# EAGLE design mp3_eval (EAGLE 6.4)

## Sheet 1 of 10: Power Supply
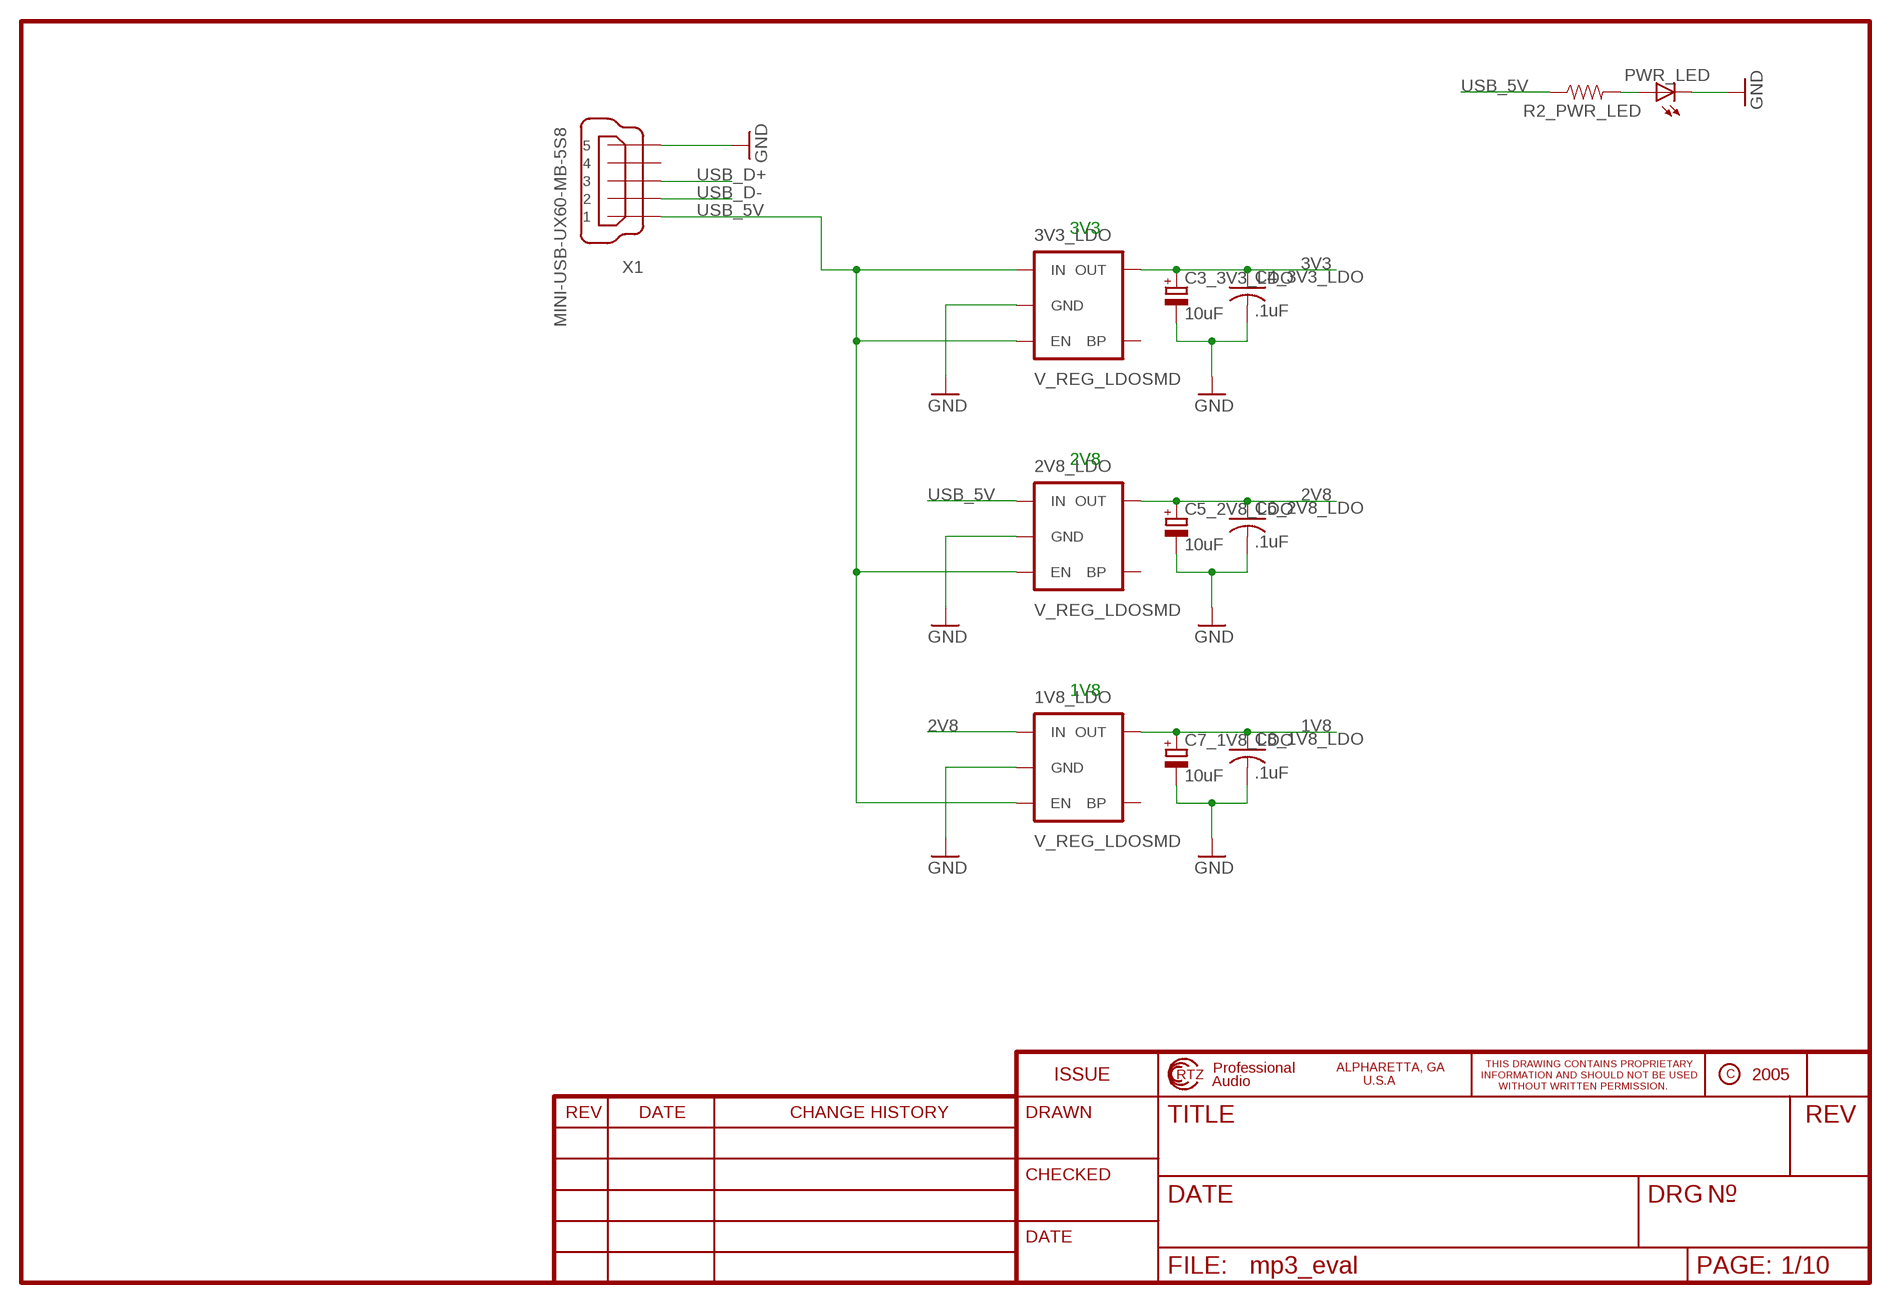
[diagram p0: schematic, sheet 1]

### Parts
1V8_LDO  V_REG_LDOSMD  [SOT23-5]
2V8_LDO  V_REG_LDOSMD  [SOT23-5]
3V3_LDO  V_REG_LDOSMD  [SOT23-5]
C3_3V3_LDO  10uF  CAPACITOR_POL-SMC_A  [SMC_A]
C4_3V3_LDO  .1uF  C-USC0402  [C0402]
C5_2V8_LDO  10uF  CAPACITOR_POL-SMC_A  [SMC_A]
C6_2V8_LDO  .1uF  C-USC0402  [C0402]
C7_1V8_LDO  10uF  CAPACITOR_POL-SMC_A  [SMC_A]
C8_1V8_LDO  .1uF  C-USC0402  [C0402]
PWR_LED  LEDCHIP-LED0603  [CHIP-LED0603]
R2_PWR_LED  RESISTOR0402-RES  [0402-RES]
X1  MINI-USB-UX60-MB-5S8  [UX60-MB-5S8]

### Nets
1V8: 1V8_LDO.5(OUT) C7_1V8_LDO.+ C8_1V8_LDO.1 ; also sheet 2,5
2V8: 1V8_LDO.1(IN) 2V8_LDO.5(OUT) C5_2V8_LDO.+ C6_2V8_LDO.1 ; also sheet 5
3V3: 3V3_LDO.5(OUT) C3_3V3_LDO.+ C4_3V3_LDO.1 ; also sheet 2,3,4,5,6
GND: 1V8_LDO.2(GND) 2V8_LDO.2(GND) 3V3_LDO.2(GND) C3_3V3_LDO.- C4_3V3_LDO.2 C5_2V8_LDO.- C6_2V8_LDO.2 C7_1V8_LDO.- C8_1V8_LDO.2 PWR_LED.C X1.5 ; also sheet 2,3,4,5,6
N$1: PWR_LED.A R2_PWR_LED.2
USB_5V: 1V8_LDO.3(EN) 2V8_LDO.1(IN) 2V8_LDO.3(EN) 3V3_LDO.1(IN) 3V3_LDO.3(EN) R2_PWR_LED.1 X1.1
USB_D+: X1.3 ; also sheet 9
USB_D-: X1.2 ; also sheet 9
Unconnected: 1V8_LDO.4(BP) 2V8_LDO.4(BP) 3V3_LDO.4(BP) X1.4

### Notes on the sheet
- 3V3
- 2V8
- 1V8

## Sheet 2 of 10: Header Pins
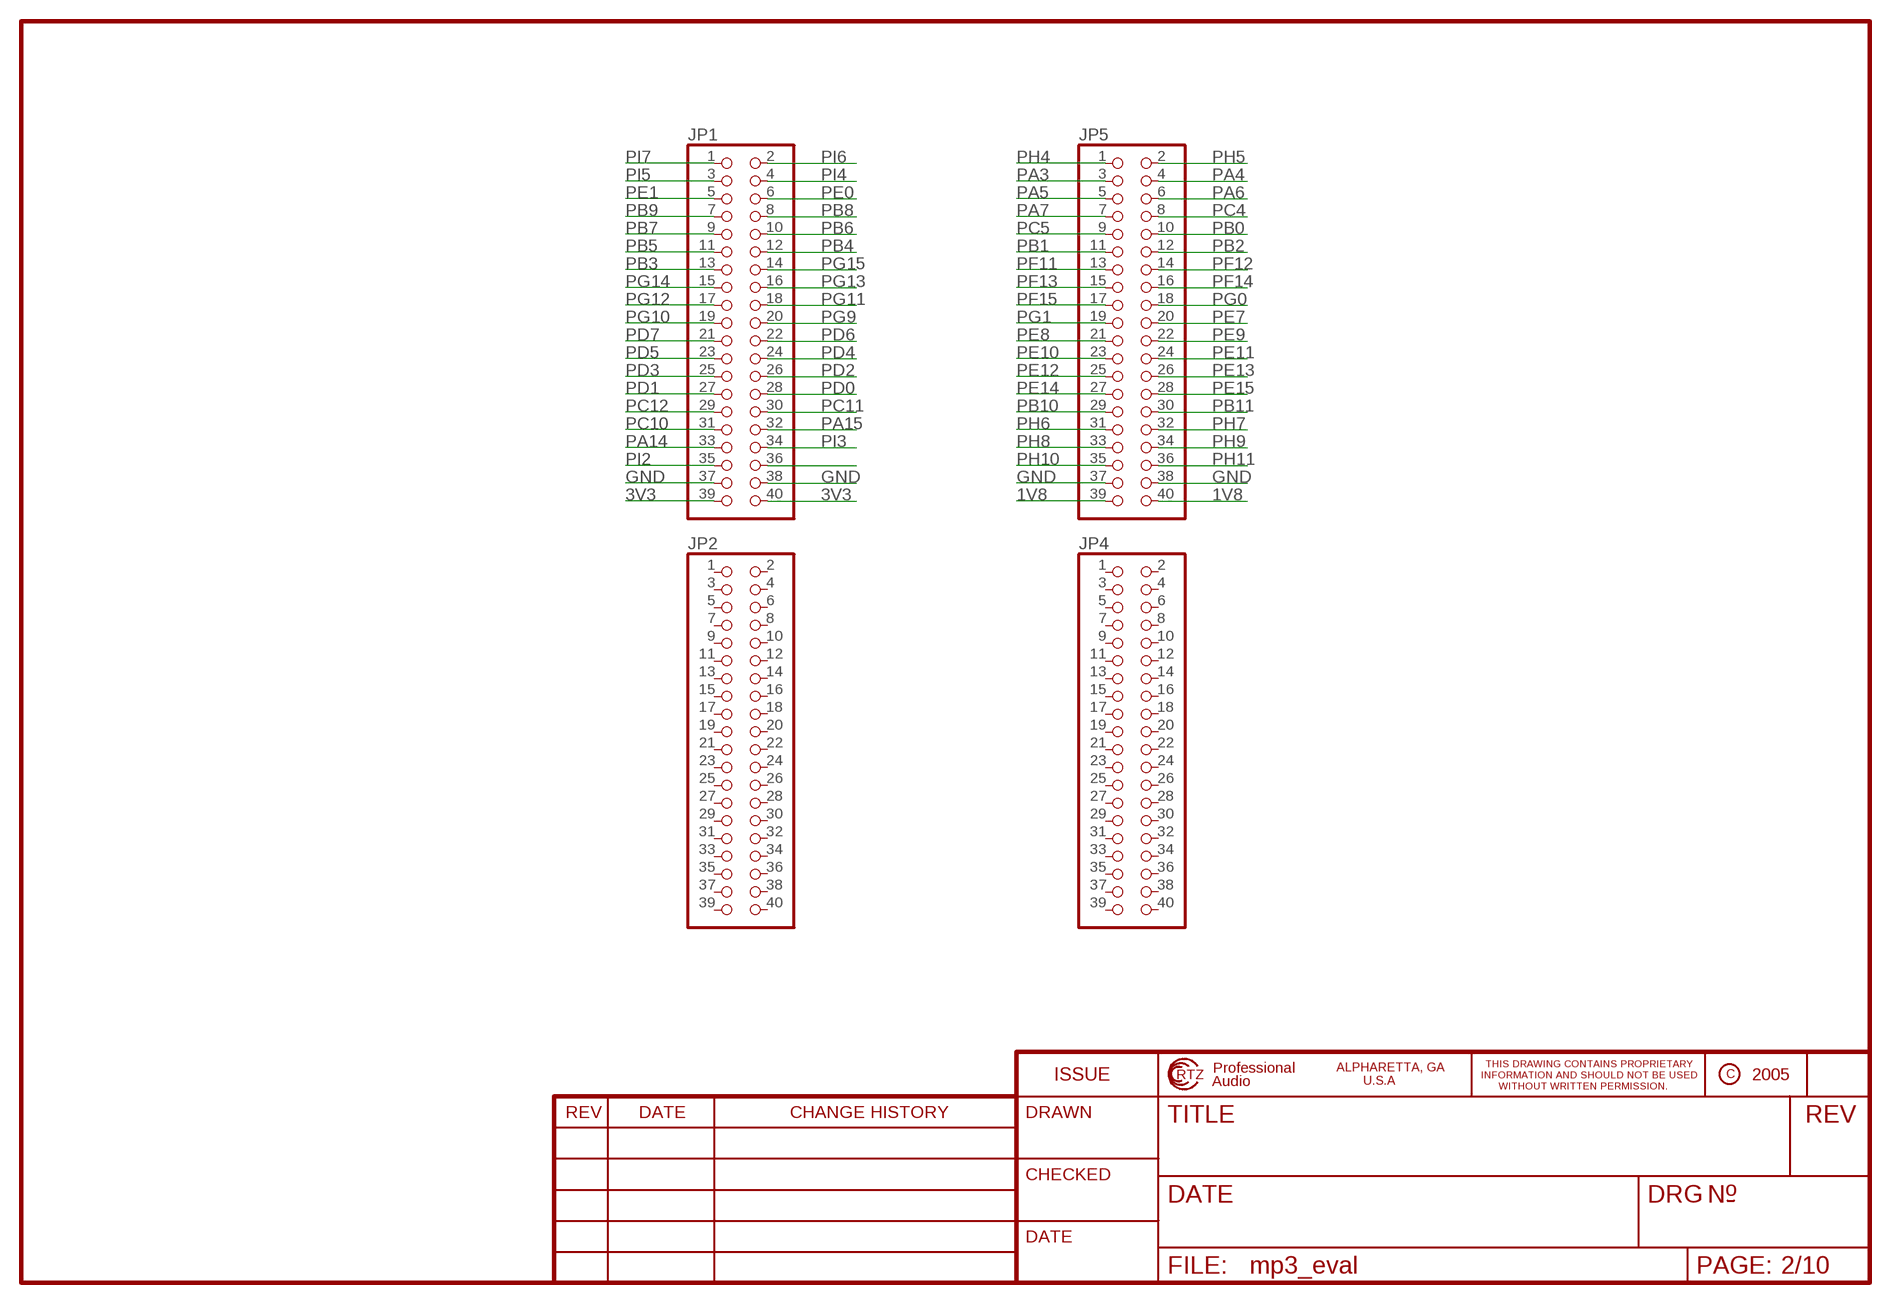
[diagram p1: schematic, sheet 2]

### Parts
JP1  PINHD-2X20  [2X20]
JP2  PINHD-2X20  [2X20]
JP4  PINHD-2X20  [2X20]
JP5  PINHD-2X20  [2X20]

### Nets
1V8: JP5.39 JP5.40 ; also sheet 1,5
3V3: JP1.39 JP1.40 ; also sheet 1,3,4,5,6
GND: JP1.37 JP1.38 JP5.37 JP5.38 ; also sheet 1,3,4,5,6
N$25: JP1.36
PA3: JP5.3 ; also sheet 3
PA4: JP5.4 ; also sheet 3
PA5: JP5.5 ; also sheet 3
PA6: JP5.6 ; also sheet 3
PA7: JP5.7 ; also sheet 3
PA14: JP1.33 ; also sheet 3
PA15: JP1.32 ; also sheet 3
PB0: JP5.10 ; also sheet 3
PB1: JP5.11 ; also sheet 3
PB2: JP5.12 ; also sheet 3
PB3: JP1.13 ; also sheet 3
PB4: JP1.12 ; also sheet 3
PB5: JP1.11 ; also sheet 3,4
PB6: JP1.10 ; also sheet 3,4
PB7: JP1.9 ; also sheet 3
PB8: JP1.8 ; also sheet 3
PB9: JP1.7 ; also sheet 3
PB10: JP5.29 ; also sheet 3
PB11: JP5.30 ; also sheet 3
PC4: JP5.8 ; also sheet 3
PC5: JP5.9 ; also sheet 3
PC10: JP1.31 ; also sheet 3
PC11: JP1.30 ; also sheet 3
PC12: JP1.29 ; also sheet 3
PD0: JP1.28 ; also sheet 3,4
PD1: JP1.27 ; also sheet 3,4
PD2: JP1.26 ; also sheet 3
PD3: JP1.25 ; also sheet 3
PD4: JP1.24 ; also sheet 3
PD5: JP1.23 ; also sheet 3
PD6: JP1.22 ; also sheet 3
PD7: JP1.21 ; also sheet 3
PE0: JP1.6 ; also sheet 3,4
PE1: JP1.5 ; also sheet 3,4
PE7: JP5.20 ; also sheet 3,4
PE8: JP5.21 ; also sheet 3,4
PE9: JP5.22 ; also sheet 3,4
PE10: JP5.23 ; also sheet 3,4
PE11: JP5.24 ; also sheet 3,4
PE12: JP5.25 ; also sheet 3,4
PE13: JP5.26 ; also sheet 3,4
PE14: JP5.27 ; also sheet 3,4
PE15: JP5.28 ; also sheet 3,4
PF11: JP5.13 ; also sheet 3,4
PF12: JP5.14 ; also sheet 3,4
PF13: JP5.15 ; also sheet 3,4
PF14: JP5.16 ; also sheet 3,4
PF15: JP5.17 ; also sheet 3,4
PG0: JP5.18 ; also sheet 3,4
PG1: JP5.19 ; also sheet 3,4
PG9: JP1.20 ; also sheet 3
PG10: JP1.19 ; also sheet 3
PG11: JP1.18 ; also sheet 3
PG12: JP1.17 ; also sheet 3
PG13: JP1.16 ; also sheet 3
PG14: JP1.15 ; also sheet 3
PG15: JP1.14 ; also sheet 3,4
PH4: JP5.1 ; also sheet 3
PH5: JP5.2 ; also sheet 3
PH6: JP5.31 ; also sheet 3
PH7: JP5.32 ; also sheet 3
PH8: JP5.33 ; also sheet 3
PH9: JP5.34 ; also sheet 3
PH10: JP5.35 ; also sheet 3
PH11: JP5.36 ; also sheet 3
PI2: JP1.35 ; also sheet 3
PI3: JP1.34 ; also sheet 3
PI4: JP1.4 ; also sheet 3
PI5: JP1.3 ; also sheet 3
PI6: JP1.2 ; also sheet 3
PI7: JP1.1 ; also sheet 3
Unconnected: JP2.1 JP2.2 JP2.3 JP2.4 JP2.5 JP2.6 JP2.7 JP2.8 JP2.9 JP2.10 JP2.11 JP2.12 JP2.13 JP2.14 JP2.15 JP2.16 JP2.17 JP2.18 JP2.19 JP2.20 JP2.21 JP2.22 JP2.23 JP2.24 JP2.25 JP2.26 JP2.27 JP2.28 JP2.29 JP2.30 JP2.31 JP2.32 JP2.33 JP2.34 JP2.35 JP2.36 JP2.37 JP2.38 JP2.39 JP2.40 JP4.1 JP4.2 JP4.3 JP4.4 JP4.5 JP4.6 JP4.7 JP4.8 JP4.9 JP4.10 JP4.11 JP4.12 JP4.13 JP4.14 JP4.15 JP4.16 JP4.17 JP4.18 JP4.19 JP4.20 JP4.21 JP4.22 JP4.23 JP4.24 JP4.25 JP4.26 JP4.27 JP4.28 JP4.29 JP4.30 JP4.31 JP4.32 JP4.33 JP4.34 JP4.35 JP4.36 JP4.37 JP4.38 JP4.39 JP4.40

## Sheet 3 of 10: STM32F439IIT
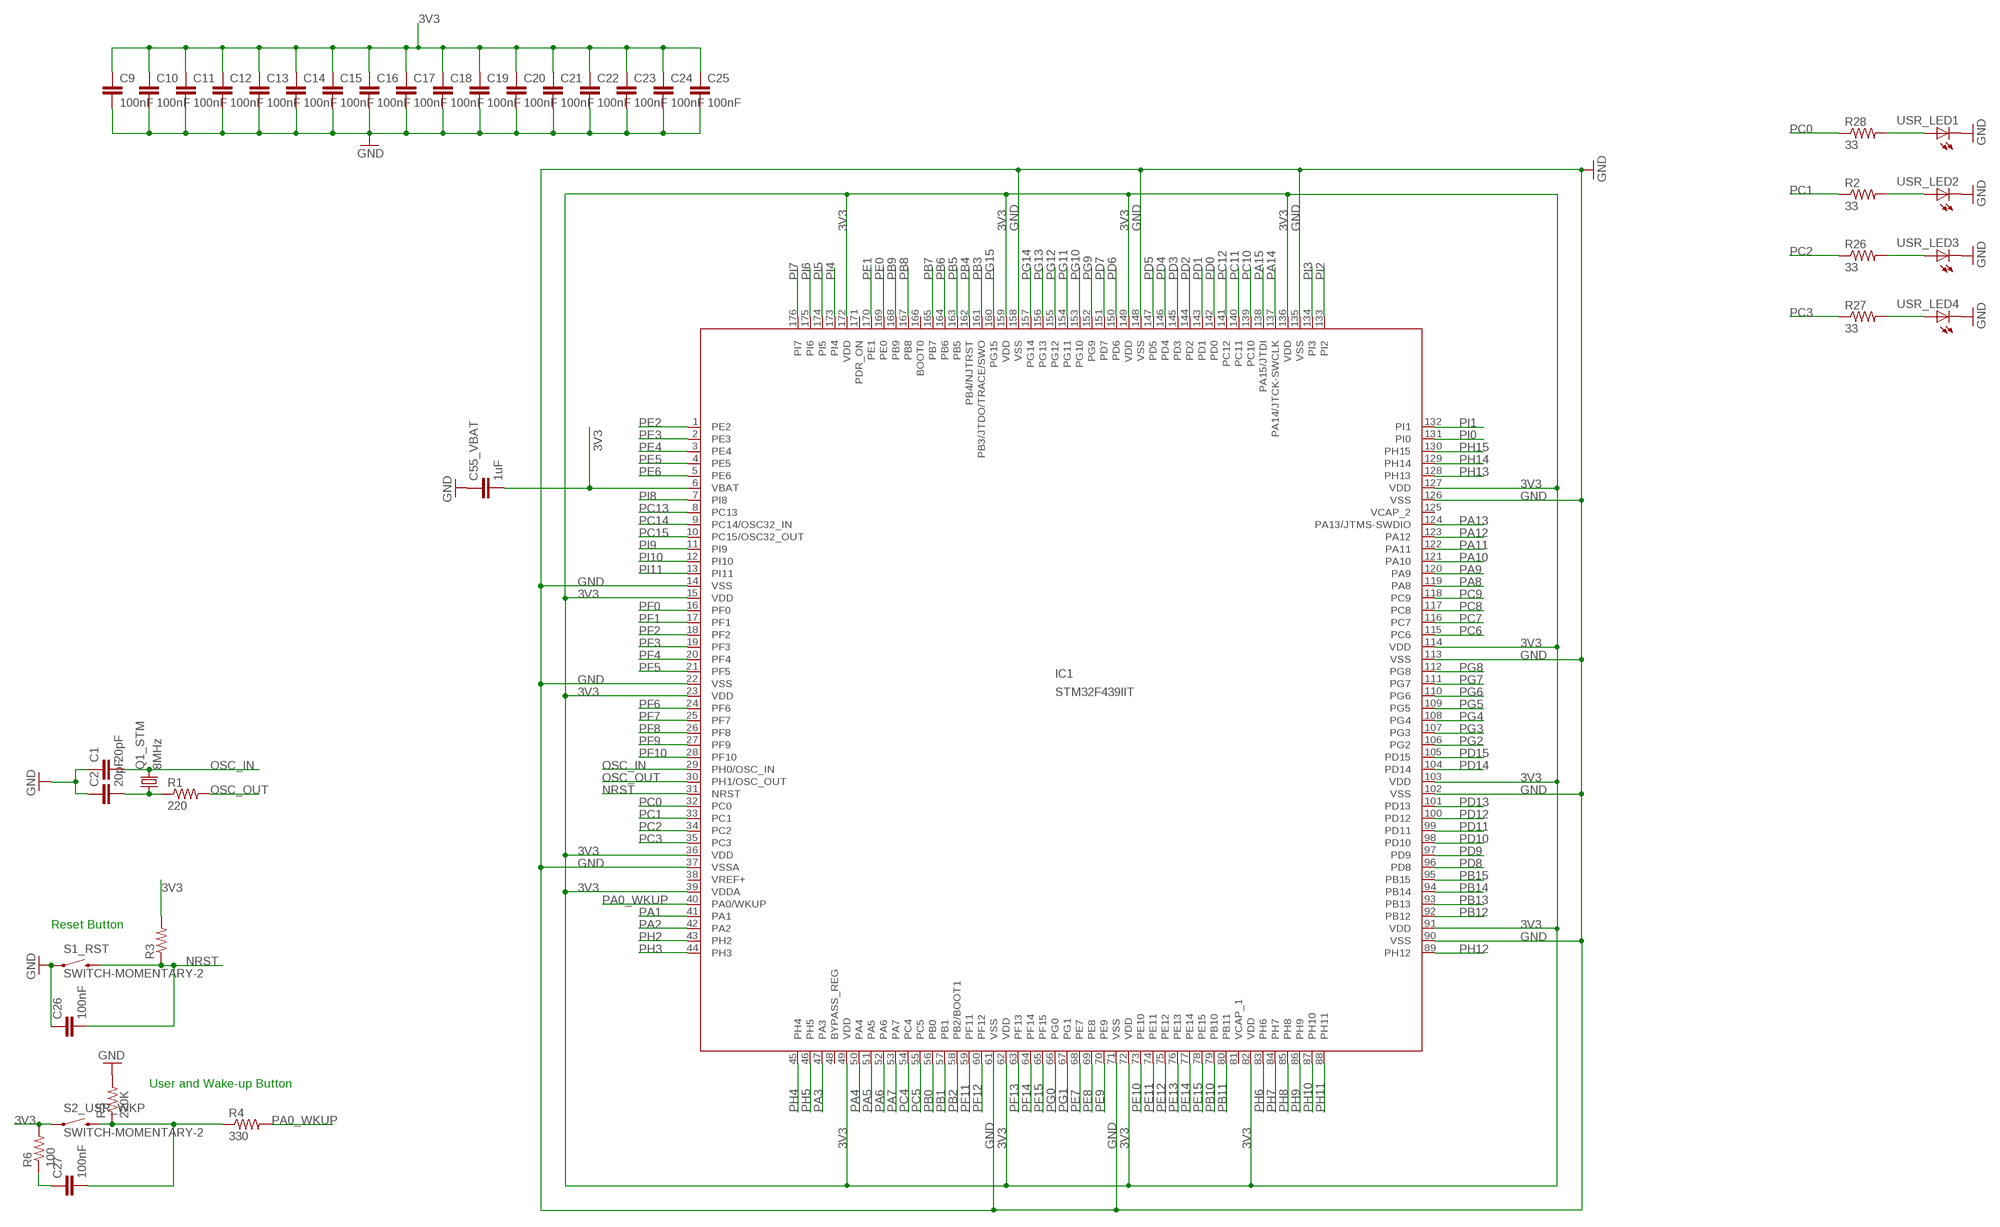
[diagram p2: schematic, sheet 3]

### Parts
C1  20pF  C-EUC0402  [C0402]
C2  20pF  C-EUC0402  [C0402]
C9  100nF  C-EUC0402  [C0402]
C10  100nF  C-EUC0402  [C0402]
C11  100nF  C-EUC0402  [C0402]
C12  100nF  C-EUC0402  [C0402]
C13  100nF  C-EUC0402  [C0402]
C14  100nF  C-EUC0402  [C0402]
C15  100nF  C-EUC0402  [C0402]
C16  100nF  C-EUC0402  [C0402]
C17  100nF  C-EUC0402  [C0402]
C18  100nF  C-EUC0402  [C0402]
C19  100nF  C-EUC0402  [C0402]
C20  100nF  C-EUC0402  [C0402]
C21  100nF  C-EUC0402  [C0402]
C22  100nF  C-EUC0402  [C0402]
C23  100nF  C-EUC0402  [C0402]
C24  100nF  C-EUC0402  [C0402]
C25  100nF  C-EUC0402  [C0402]
C26  100nF  C-EUC0402  [C0402]
C27  100nF  C-EUC0402  [C0402]
C55_VBAT  1uF  C-EUC0402  [C0402]
IC1  STM32F439IIT  [LQFP-176]
Q1_STM  8MHz  CRYSTALCTS406  [CTS406]
R1  220  RESISTOR0402-RES  [0402-RES]
R2  33  RESISTOR0402-RES  [0402-RES]
R3  RESISTOR0402-RES  [0402-RES]
R4  330  RESISTOR0402-RES  [0402-RES]
R5  220K  RESISTOR0402-RES  [0402-RES]
R6  100  RESISTOR0402-RES  [0402-RES]
R26  33  RESISTOR0402-RES  [0402-RES]
R27  33  RESISTOR0402-RES  [0402-RES]
R28  33  RESISTOR0402-RES  [0402-RES]
S1_RST  SWITCH-MOMENTARY-2  [TACTILE_SWITCH_TALL]
S2_USR_WKP  SWITCH-MOMENTARY-2  [TACTILE_SWITCH_TALL]
USR_LED1  LEDCHIPLED_0805  [CHIPLED_0805]
USR_LED2  LEDCHIPLED_0805  [CHIPLED_0805]
USR_LED3  LEDCHIPLED_0805  [CHIPLED_0805]
USR_LED4  LEDCHIPLED_0805  [CHIPLED_0805]

### Nets
3V3: C9.1 C10.1 C11.1 C12.1 C13.1 C14.1 C15.1 C16.1 C17.1 C18.1 C19.1 C20.1 C21.1 C22.1 C23.1 C24.1 C25.1 C55_VBAT.2 IC1.6(VBAT) IC1.15(VDD) IC1.23(VDD) IC1.36(VDD) IC1.39(VDDA) IC1.49(VDD) IC1.62(VDD) IC1.72(VDD) IC1.82(VDD) IC1.91(VDD) IC1.103(VDD) IC1.114(VDD) IC1.127(VDD) IC1.136(VDD) IC1.149(VDD) IC1.159(VDD) IC1.172(VDD) R3.2 R6.2 S2_USR_WKP.A2 ; also sheet 1,2,4,5,6
GND: C1.1 C2.1 C9.2 C10.2 C11.2 C12.2 C13.2 C14.2 C15.2 C16.2 C17.2 C18.2 C19.2 C20.2 C21.2 C22.2 C23.2 C24.2 C25.2 C26.1 C55_VBAT.1 IC1.14(VSS) IC1.22(VSS) IC1.37(VSSA) IC1.61(VSS) IC1.71(VSS) IC1.90(VSS) IC1.102(VSS) IC1.113(VSS) IC1.126(VSS) IC1.135(VSS) IC1.148(VSS) IC1.158(VSS) R5.2 S1_RST.A2 USR_LED1.C USR_LED2.C USR_LED3.C USR_LED4.C ; also sheet 1,2,4,5,6
N$2: C2.2 Q1_STM.1 R1.1
N$3: C27.2 R4.1 R5.1 S2_USR_WKP.B2
N$4: C27.1 R6.1
N$19: R28.2 USR_LED1.A
N$20: R2.2 USR_LED2.A
N$21: R26.2 USR_LED3.A
N$22: R27.2 USR_LED4.A
NRST: C26.2 IC1.31(NRST) R3.1 S1_RST.B2
OSC_IN: C1.2 IC1.29(PH0/OSC_IN) Q1_STM.3
OSC_OUT: IC1.30(PH1/OSC_OUT) R1.2
PA0_WKUP: IC1.40(PA0/WKUP) R4.2
PA1: IC1.41(PA1)
PA2: IC1.42(PA2)
PA3: IC1.47(PA3) ; also sheet 2
PA4: IC1.50(PA4) ; also sheet 2
PA5: IC1.51(PA5) ; also sheet 2
PA6: IC1.52(PA6) ; also sheet 2
PA7: IC1.53(PA7) ; also sheet 2
PA8: IC1.119(PA8)
PA9: IC1.120(PA9)
PA10: IC1.121(PA10)
PA11: IC1.122(PA11)
PA12: IC1.123(PA12) ; also sheet 6
PA13: IC1.124(PA13/JTMS-SWDIO)
PA14: IC1.137(PA14/JTCK-SWCLK) ; also sheet 2
PA15: IC1.138(PA15/JTDI) ; also sheet 2
PB0: IC1.56(PB0) ; also sheet 2
PB1: IC1.57(PB1) ; also sheet 2
PB2: IC1.58(PB2/BOOT1) ; also sheet 2
PB3: IC1.161(PB3/JTDO/TRACE/SWO) ; also sheet 2
PB4: IC1.162(PB4/NJTRST) ; also sheet 2
PB5: IC1.163(PB5) ; also sheet 2,4
PB6: IC1.164(PB6) ; also sheet 2,4
PB7: IC1.165(PB7) ; also sheet 2
PB8: IC1.167(PB8) ; also sheet 2
PB9: IC1.168(PB9) ; also sheet 2
PB10: IC1.79(PB10) ; also sheet 2
PB11: IC1.80(PB11) ; also sheet 2
PB12: IC1.92(PB12)
PB13: IC1.93(PB13)
PB14: IC1.94(PB14)
PB15: IC1.95(PB15)
PC0: IC1.32(PC0) R28.1 ; also sheet 4
PC1: IC1.33(PC1) R2.1
PC2: IC1.34(PC2) R26.1
PC3: IC1.35(PC3) R27.1
PC4: IC1.54(PC4) ; also sheet 2
PC5: IC1.55(PC5) ; also sheet 2
PC6: IC1.115(PC6)
PC7: IC1.116(PC7)
PC8: IC1.117(PC8)
PC9: IC1.118(PC9)
PC10: IC1.139(PC10) ; also sheet 2
PC11: IC1.140(PC11) ; also sheet 2
PC12: IC1.141(PC12) ; also sheet 2
PC13: IC1.8(PC13)
PC14: IC1.9(PC14/OSC32_IN)
PC15: IC1.10(PC15/OSC32_OUT)
PD0: IC1.142(PD0) ; also sheet 2,4
PD1: IC1.143(PD1) ; also sheet 2,4
PD2: IC1.144(PD2) ; also sheet 2
PD3: IC1.145(PD3) ; also sheet 2
PD4: IC1.146(PD4) ; also sheet 2
PD5: IC1.147(PD5) ; also sheet 2
PD6: IC1.150(PD6) ; also sheet 2
PD7: IC1.151(PD7) ; also sheet 2
PD8: IC1.96(PD8) ; also sheet 4
PD9: IC1.97(PD9) ; also sheet 4
PD10: IC1.98(PD10) ; also sheet 4
PD11: IC1.99(PD11)
PD12: IC1.100(PD12)
PD13: IC1.101(PD13)
PD14: IC1.104(PD14) ; also sheet 4
PD15: IC1.105(PD15) ; also sheet 4
PE0: IC1.169(PE0) ; also sheet 2,4
PE1: IC1.170(PE1) ; also sheet 2,4
PE2: IC1.1(PE2)
PE3: IC1.2(PE3)
PE4: IC1.3(PE4)
PE5: IC1.4(PE5)
PE6: IC1.5(PE6)
PE7: IC1.68(PE7) ; also sheet 2,4
PE8: IC1.69(PE8) ; also sheet 2,4
PE9: IC1.70(PE9) ; also sheet 2,4
PE10: IC1.73(PE10) ; also sheet 2,4
PE11: IC1.74(PE11) ; also sheet 2,4
PE12: IC1.75(PE12) ; also sheet 2,4
PE13: IC1.76(PE13) ; also sheet 2,4
PE14: IC1.77(PE14) ; also sheet 2,4
PE15: IC1.78(PE15) ; also sheet 2,4
PF0: IC1.16(PF0) ; also sheet 4
PF1: IC1.17(PF1) ; also sheet 4
PF2: IC1.18(PF2) ; also sheet 4
PF3: IC1.19(PF3) ; also sheet 4
PF4: IC1.20(PF4) ; also sheet 4
PF5: IC1.21(PF5) ; also sheet 4
PF6: IC1.24(PF6)
PF7: IC1.25(PF7)
PF8: IC1.26(PF8)
PF9: IC1.27(PF9)
PF10: IC1.28(PF10)
PF11: IC1.59(PF11) ; also sheet 2,4
PF12: IC1.60(PF12) ; also sheet 2,4
PF13: IC1.63(PF13) ; also sheet 2,4
PF14: IC1.64(PF14) ; also sheet 2,4
PF15: IC1.65(PF15) ; also sheet 2,4
PG0: IC1.66(PG0) ; also sheet 2,4
PG1: IC1.67(PG1) ; also sheet 2,4
PG2: IC1.106(PG2)
PG3: IC1.107(PG3)
PG4: IC1.108(PG4) ; also sheet 4
PG5: IC1.109(PG5) ; also sheet 4
PG6: IC1.110(PG6)
PG7: IC1.111(PG7)
PG8: IC1.112(PG8) ; also sheet 4
PG9: IC1.152(PG9) ; also sheet 2
PG10: IC1.153(PG10) ; also sheet 2
PG11: IC1.154(PG11) ; also sheet 2
PG12: IC1.155(PG12) ; also sheet 2
PG13: IC1.156(PG13) ; also sheet 2
PG14: IC1.157(PG14) ; also sheet 2
PG15: IC1.160(PG15) ; also sheet 2,4
PH2: IC1.43(PH2)
PH3: IC1.44(PH3)
PH4: IC1.45(PH4) ; also sheet 2
PH5: IC1.46(PH5) ; also sheet 2
PH6: IC1.83(PH6) ; also sheet 2
PH7: IC1.84(PH7) ; also sheet 2
PH8: IC1.85(PH8) ; also sheet 2
PH9: IC1.86(PH9) ; also sheet 2
PH10: IC1.87(PH10) ; also sheet 2
PH11: IC1.88(PH11) ; also sheet 2
PH12: IC1.89(PH12)
PH13: IC1.128(PH13)
PH14: IC1.129(PH14)
PH15: IC1.130(PH15)
PI0: IC1.131(PI0)
PI1: IC1.132(PI1)
PI2: IC1.133(PI2) ; also sheet 2
PI3: IC1.134(PI3) ; also sheet 2
PI4: IC1.173(PI4) ; also sheet 2
PI5: IC1.174(PI5) ; also sheet 2
PI6: IC1.175(PI6) ; also sheet 2
PI7: IC1.176(PI7) ; also sheet 2
PI8: IC1.7(PI8)
PI9: IC1.11(PI9)
PI10: IC1.12(PI10)
PI11: IC1.13(PI11)
Unconnected: IC1.48(BYPASS_REG) IC1.166(BOOT0)

### Notes on the sheet
- Reset Button
- User and Wake-up Button

## Sheet 4 of 10: SRAM
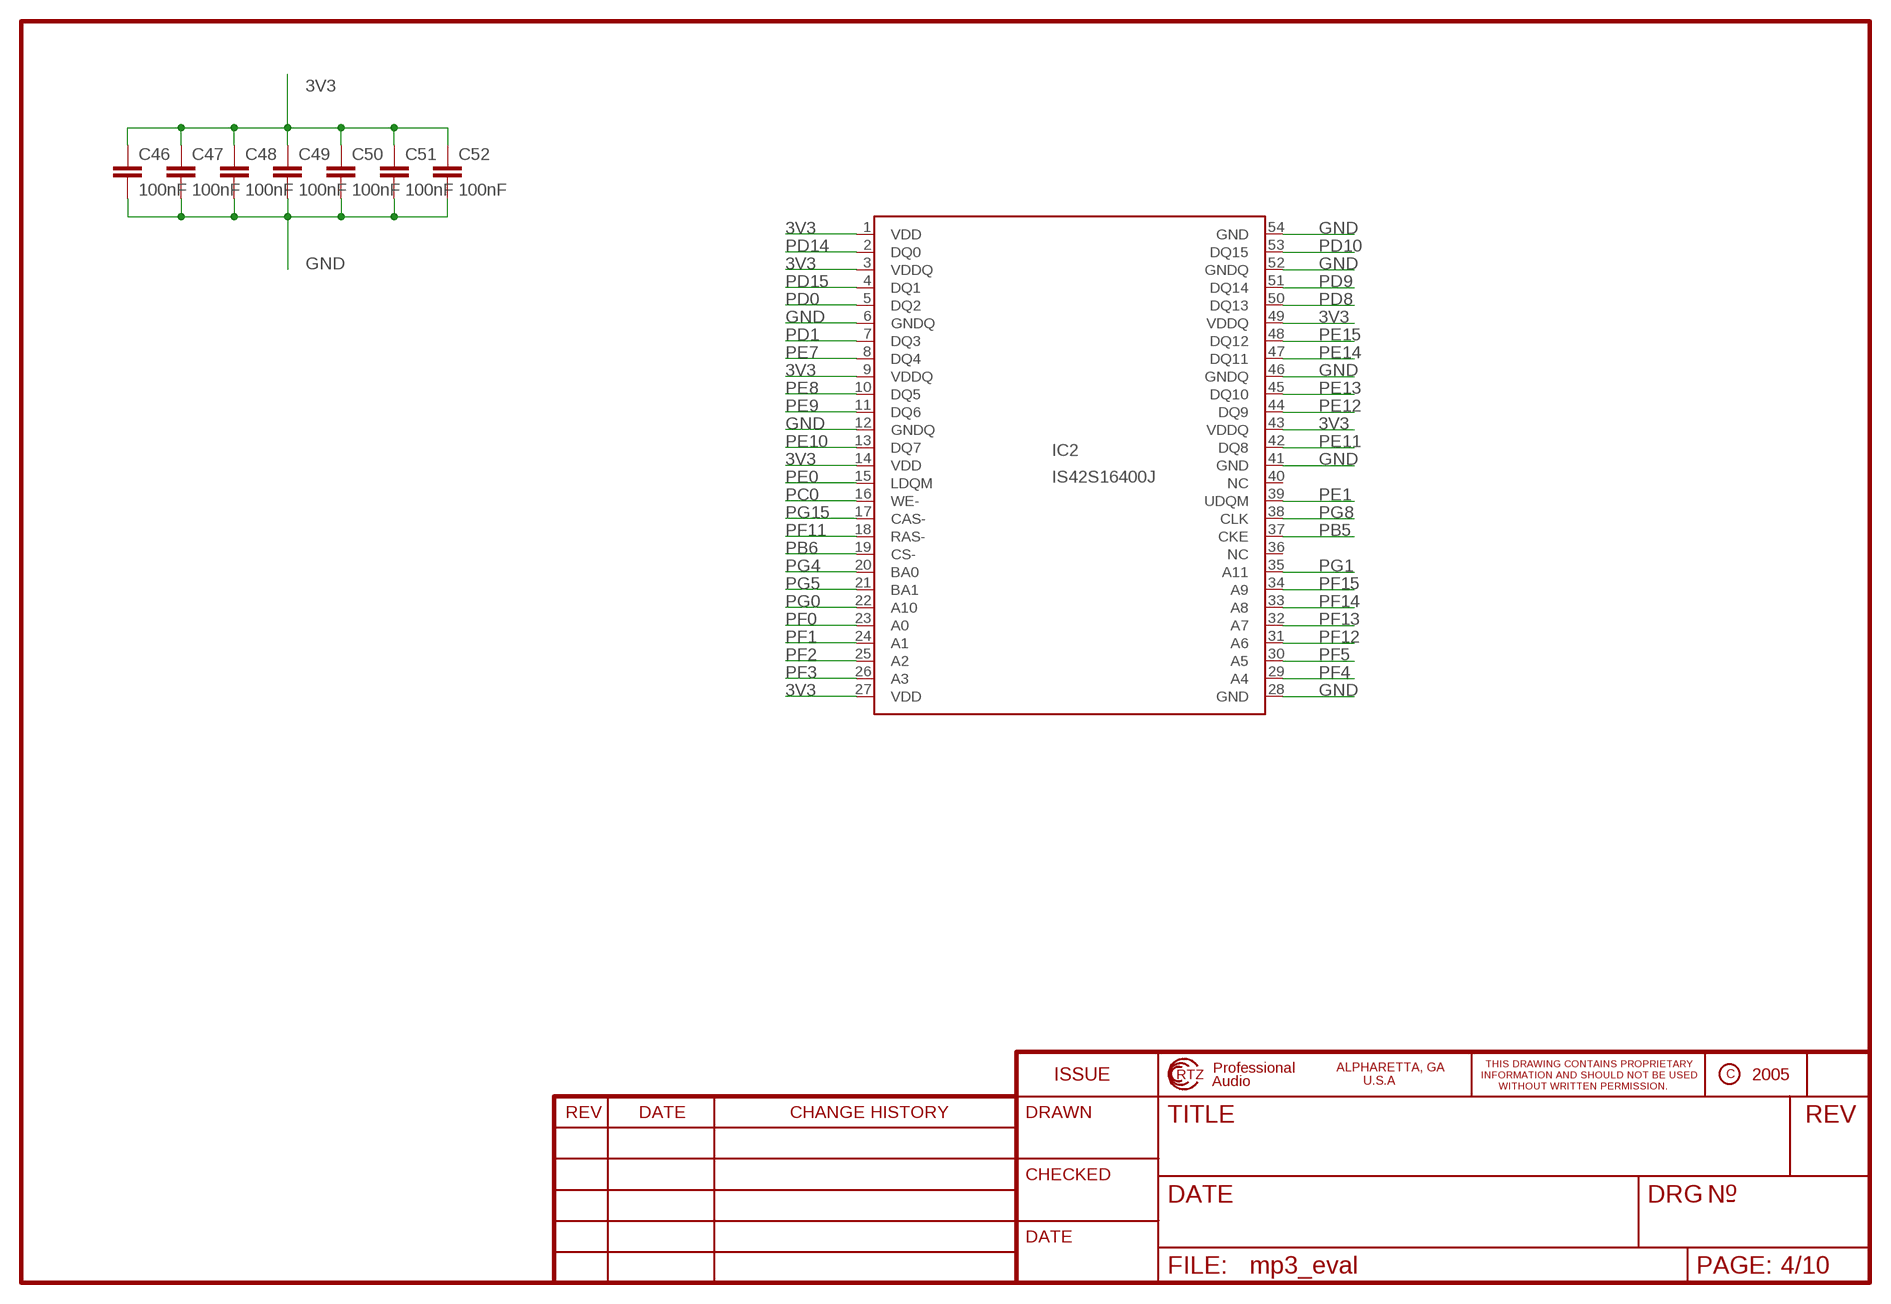
[diagram p3: schematic, sheet 4]

### Parts
C46  100nF  C-EUC0402  [C0402]
C47  100nF  C-EUC0402  [C0402]
C48  100nF  C-EUC0402  [C0402]
C49  100nF  C-EUC0402  [C0402]
C50  100nF  C-EUC0402  [C0402]
C51  100nF  C-EUC0402  [C0402]
C52  100nF  C-EUC0402  [C0402]
IC2  IS42S16400J  [TSOP-2]

### Nets
3V3: C46.1 C47.1 C48.1 C49.1 C50.1 C51.1 C52.1 IC2.1(VDD) IC2.3(VDDQ) IC2.9(VDDQ) IC2.14(VDD) IC2.27(VDD) IC2.43(VDDQ) IC2.49(VDDQ) ; also sheet 1,2,3,5,6
GND: C46.2 C47.2 C48.2 C49.2 C50.2 C51.2 C52.2 IC2.6(GNDQ) IC2.12(GNDQ) IC2.28(GND) IC2.41(GND) IC2.46(GNDQ) IC2.52(GNDQ) IC2.54(GND) ; also sheet 1,2,3,5,6
PB5: IC2.37(CKE) ; also sheet 2,3
PB6: IC2.19(CS-) ; also sheet 2,3
PC0: IC2.16(WE-) ; also sheet 3
PD0: IC2.5(DQ2) ; also sheet 2,3
PD1: IC2.7(DQ3) ; also sheet 2,3
PD8: IC2.50(DQ13) ; also sheet 3
PD9: IC2.51(DQ14) ; also sheet 3
PD10: IC2.53(DQ15) ; also sheet 3
PD14: IC2.2(DQ0) ; also sheet 3
PD15: IC2.4(DQ1) ; also sheet 3
PE0: IC2.15(LDQM) ; also sheet 2,3
PE1: IC2.39(UDQM) ; also sheet 2,3
PE7: IC2.8(DQ4) ; also sheet 2,3
PE8: IC2.10(DQ5) ; also sheet 2,3
PE9: IC2.11(DQ6) ; also sheet 2,3
PE10: IC2.13(DQ7) ; also sheet 2,3
PE11: IC2.42(DQ8) ; also sheet 2,3
PE12: IC2.44(DQ9) ; also sheet 2,3
PE13: IC2.45(DQ10) ; also sheet 2,3
PE14: IC2.47(DQ11) ; also sheet 2,3
PE15: IC2.48(DQ12) ; also sheet 2,3
PF0: IC2.23(A0) ; also sheet 3
PF1: IC2.24(A1) ; also sheet 3
PF2: IC2.25(A2) ; also sheet 3
PF3: IC2.26(A3) ; also sheet 3
PF4: IC2.29(A4) ; also sheet 3
PF5: IC2.30(A5) ; also sheet 3
PF11: IC2.18(RAS-) ; also sheet 2,3
PF12: IC2.31(A6) ; also sheet 2,3
PF13: IC2.32(A7) ; also sheet 2,3
PF14: IC2.33(A8) ; also sheet 2,3
PF15: IC2.34(A9) ; also sheet 2,3
PG0: IC2.22(A10) ; also sheet 2,3
PG1: IC2.35(A11) ; also sheet 2,3
PG4: IC2.20(BA0) ; also sheet 3
PG5: IC2.21(BA1) ; also sheet 3
PG8: IC2.38(CLK) ; also sheet 3
PG15: IC2.17(CAS-) ; also sheet 2,3
Unconnected: IC2.36(NC) IC2.40(NC)

## Sheet 5 of 10: MP3 Codec
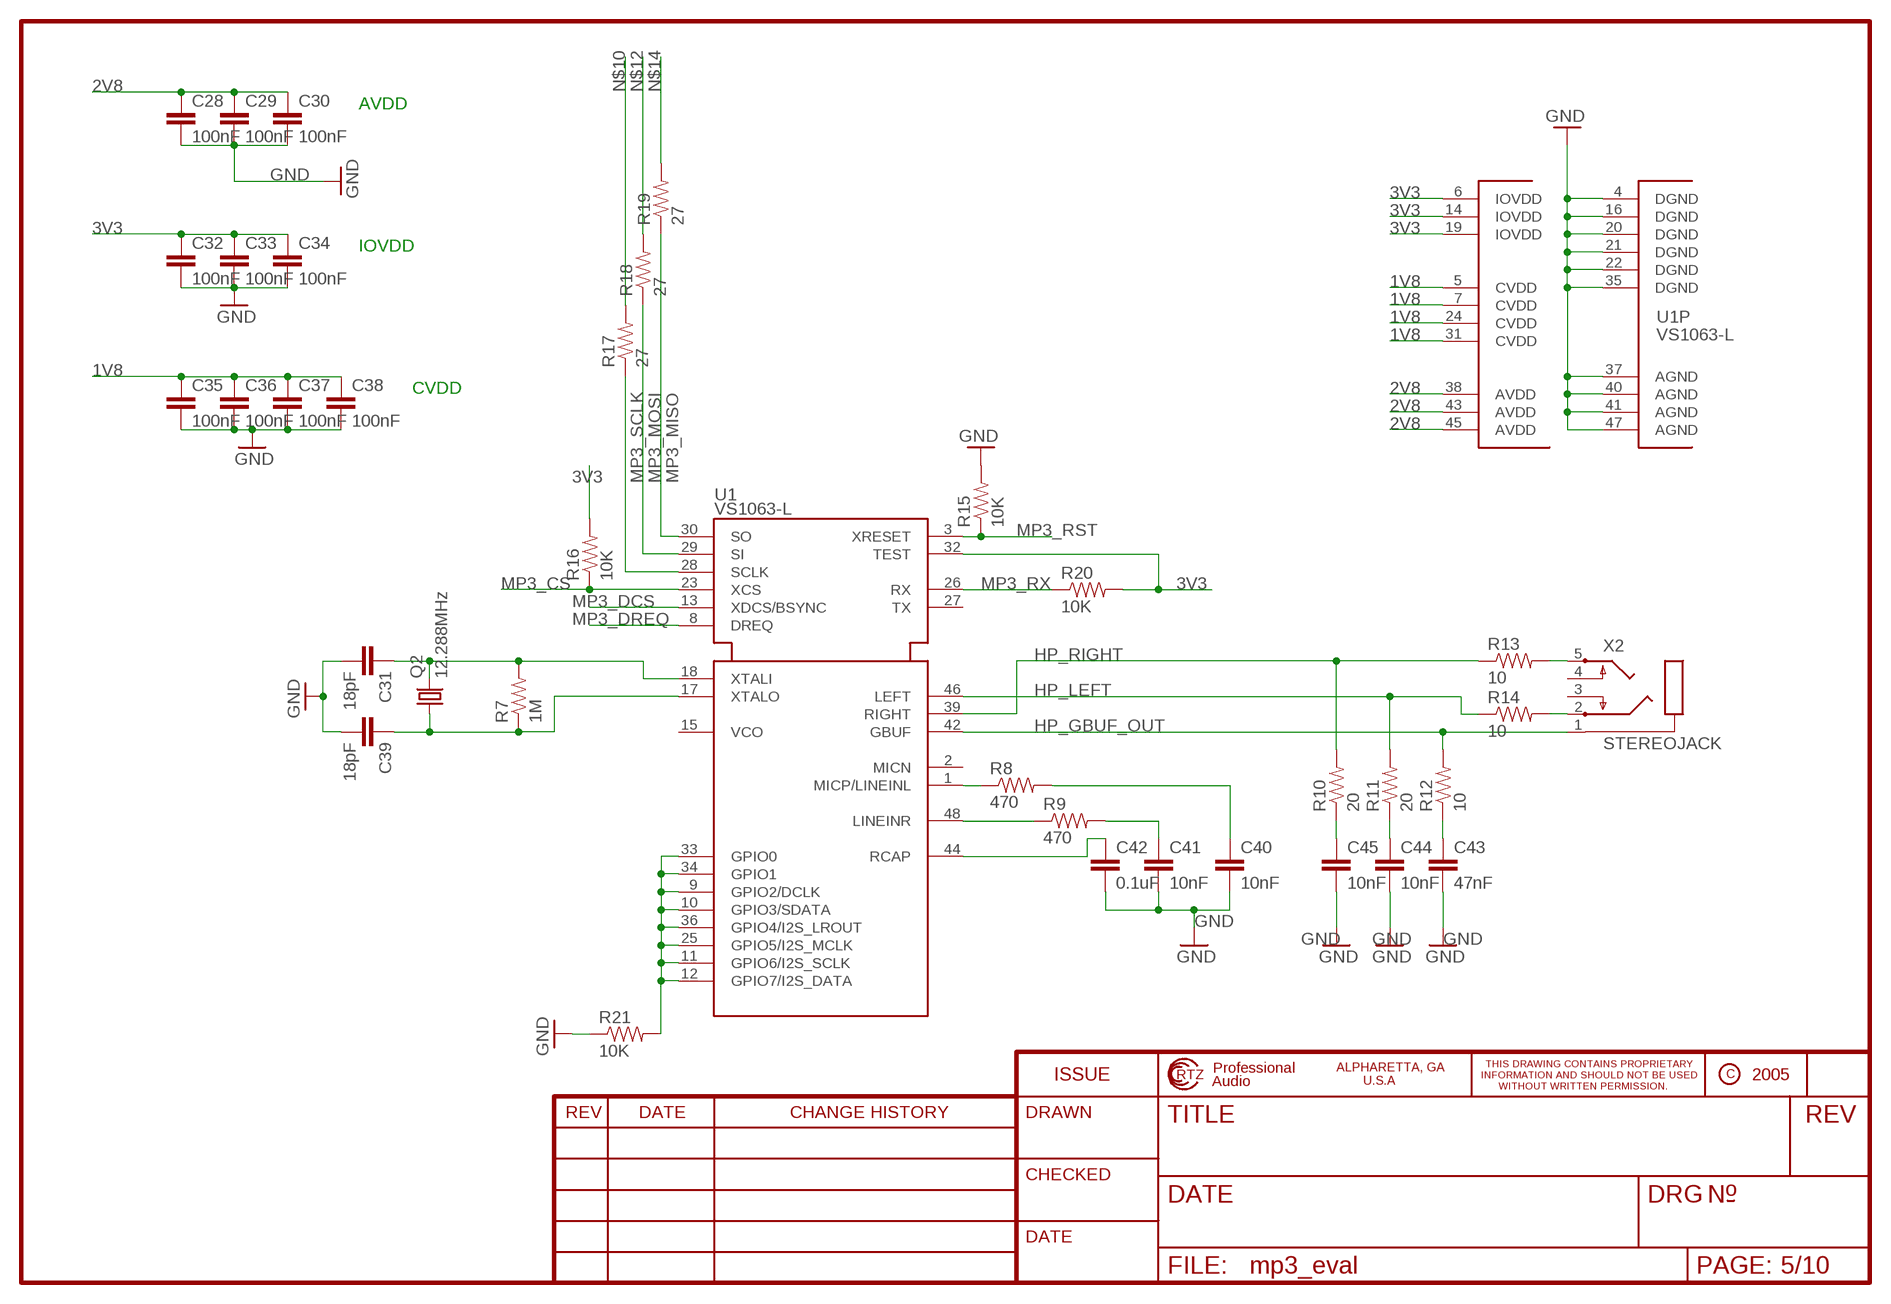
[diagram p4: schematic, sheet 5]

### Parts
C28  100nF  C-EUC0402  [C0402]
C29  100nF  C-EUC0402  [C0402]
C30  100nF  C-EUC0402  [C0402]
C31  18pF  C-EUC0402  [C0402]
C32  100nF  C-EUC0402  [C0402]
C33  100nF  C-EUC0402  [C0402]
C34  100nF  C-EUC0402  [C0402]
C35  100nF  C-EUC0402  [C0402]
C36  100nF  C-EUC0402  [C0402]
C37  100nF  C-EUC0402  [C0402]
C38  100nF  C-EUC0402  [C0402]
C39  18pF  C-EUC0402  [C0402]
C40  10nF  C-EUC0402  [C0402]
C41  10nF  C-EUC0402  [C0402]
C42  0.1uF  C-EUC0402  [C0402]
C43  47nF  C-EUC0402  [C0402]
C44  10nF  C-EUC0402  [C0402]
C45  10nF  C-EUC0402  [C0402]
Q2  12.288MHz  CRYSTALCTS406  [CTS406]
R7  1M  RESISTOR0402-RES  [0402-RES]
R8  470  RESISTOR0402-RES  [0402-RES]
R9  470  RESISTOR0402-RES  [0402-RES]
R10  20  RESISTOR0402-RES  [0402-RES]
R11  20  RESISTOR0402-RES  [0402-RES]
R12  10  RESISTOR0402-RES  [0402-RES]
R13  10  RESISTOR0402-RES  [0402-RES]
R14  10  RESISTOR0402-RES  [0402-RES]
R15  10K  RESISTOR0402-RES  [0402-RES]
R16  10K  RESISTOR0402-RES  [0402-RES]
R17  27  RESISTOR0402-RES  [0402-RES]
R18  27  RESISTOR0402-RES  [0402-RES]
R19  27  RESISTOR0402-RES  [0402-RES]
R20  10K  RESISTOR0402-RES  [0402-RES]
R21  10K  RESISTOR0402-RES  [0402-RES]
U1  VS1063-L  [LQFP48]
X2  STEREOJACK  [STX3100]

### Nets
1V8: C35.1 C36.1 C37.1 C38.1 U1.5(CVDD) U1.7(CVDD) U1.24(CVDD) U1.31(CVDD) ; also sheet 1,2
2V8: C28.1 C29.1 C30.1 U1.38(AVDD) U1.43(AVDD) U1.45(AVDD) ; also sheet 1
3V3: C32.1 C33.1 C34.1 R16.2 R20.2 U1.6(IOVDD) U1.14(IOVDD) U1.19(IOVDD) U1.32(TEST) ; also sheet 1,2,3,4,6
GND: C28.2 C29.2 C30.2 C31.2 C32.2 C33.2 C34.2 C35.2 C36.2 C37.2 C38.2 C39.2 C40.2 C41.2 C42.2 C43.2 C44.2 C45.2 R15.2 R21.1 U1.4(DGND) U1.16(DGND) U1.20(DGND) U1.21(DGND) U1.22(DGND) U1.35(DGND) U1.37(AGND) U1.40(AGND) U1.41(AGND) U1.47(AGND) ; also sheet 1,2,3,4,6
GPIO: R21.2 U1.9(GPIO2/DCLK) U1.10(GPIO3/SDATA) U1.11(GPIO6/I2S_SCLK) U1.12(GPIO7/I2S_DATA) U1.25(GPIO5/I2S_MCLK) U1.33(GPIO0) U1.34(GPIO1) U1.36(GPIO4/I2S_LROUT)
HP_GBUF_OUT: R12.2 U1.42(GBUF) X2.1
HP_L_OUT: R14.2 X2.2
HP_LEFT: R11.2 R14.1 U1.46(LEFT)
HP_R_OUT: R13.2 X2.5
HP_RIGHT: R10.2 R13.1 U1.39(RIGHT)
LINEINR: R9.1 U1.48(LINEINR)
MICP_LINEINL: R8.1 U1.1(MICP/LINEINL)
MP3_CS: R16.1 U1.23(XCS)
MP3_DCS: U1.13(XDCS/BSYNC)
MP3_DREQ: U1.8(DREQ)
MP3_MISO: R19.1 U1.30(SO)
MP3_MOSI: R18.1 U1.29(SI)
MP3_RST: R15.1 U1.3(XRESET)
MP3_RX: R20.1 U1.26(RX)
MP3_SCLK: R17.1 U1.28(SCLK)
N$6: C43.1 R12.1
N$7: C44.1 R11.1
N$9: C45.1 R10.1
N$10: R17.2
N$11: C40.1 R8.2
N$12: R18.2
N$13: C41.1 R9.2
N$14: R19.2
RCAP: C42.1 U1.44(RCAP)
XTALI: C31.1 Q2.3 R7.2 U1.18(XTALI)
XTALO: C39.1 Q2.1 R7.1 U1.17(XTALO)
Unconnected: U1.2(MICN) U1.15(VCO) U1.27(TX) X2.3 X2.4

### Notes on the sheet
- AVDD
- IOVDD
- CVDD

## Sheet 6 of 10: SDCard
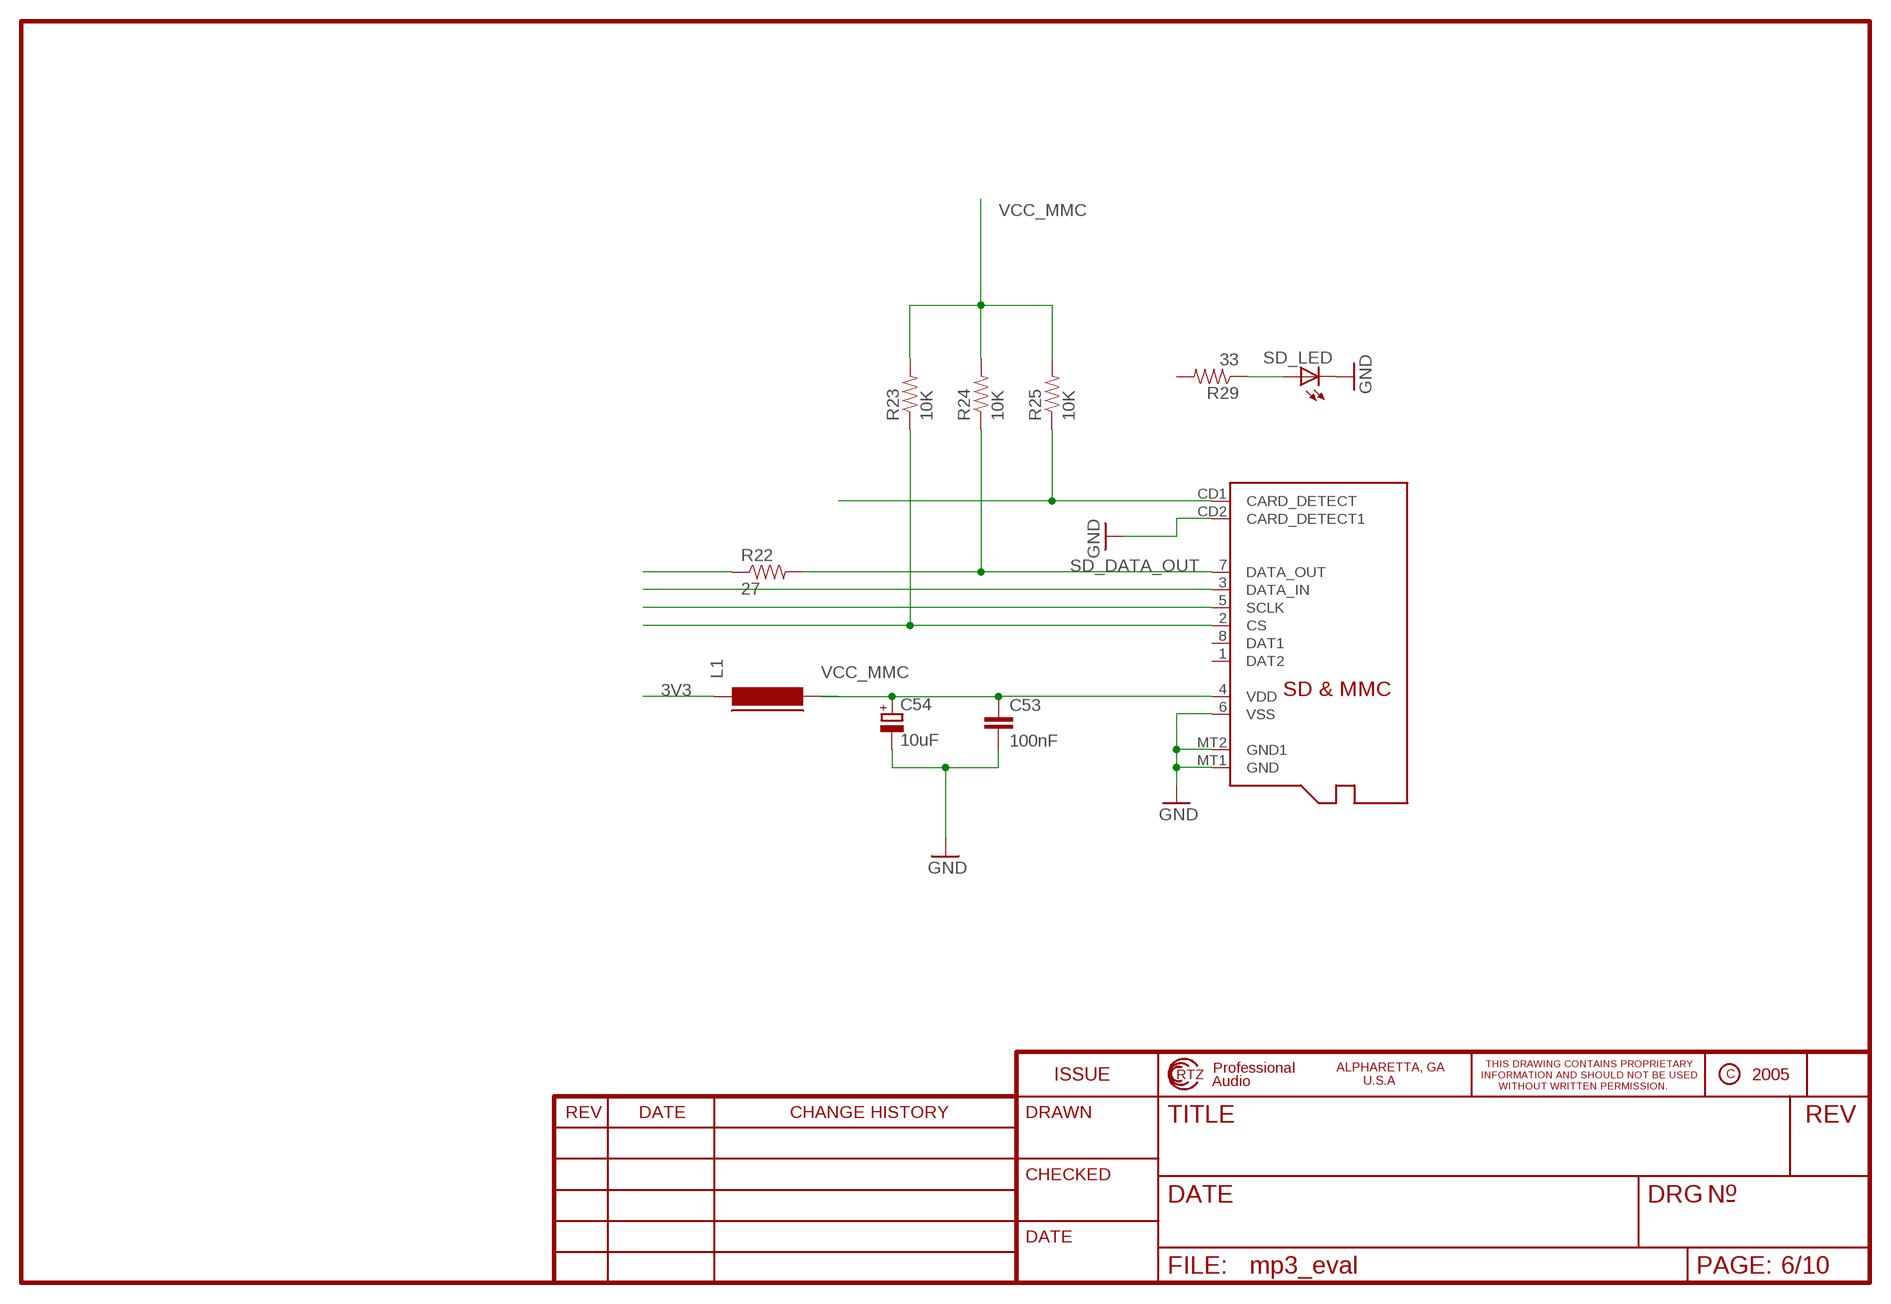
[diagram p5: schematic, sheet 6]

### Parts
C53  100nF  C-EUC0402  [C0402]
C54  10uF  CAPACITOR_POL-SMC_A  [SMC_A]
L1  FERRITE-0805  [FB805]
R22  27  RESISTOR0402-RES  [0402-RES]
R23  10K  RESISTOR0402-RES  [0402-RES]
R24  10K  RESISTOR0402-RES  [0402-RES]
R25  10K  RESISTOR0402-RES  [0402-RES]
R29  33  RESISTOR0402-RES  [0402-RES]
SD_LED  LED-0805  [LED-805]
U$1  MICROSD  [MICROSD]

### Nets
3V3: L1.1 ; also sheet 1,2,3,4,5
GND: C53.2 C54.- SD_LED.C U$1.6(VSS) U$1.CD2(CARD_DETECT1) U$1.MT1(GND) U$1.MT2(GND1) ; also sheet 1,2,3,4,5
N$15: U$1.3(DATA_IN)
N$16: U$1.5(SCLK)
N$17: R23.1 U$1.2(CS)
N$18: R22.1
N$23: R29.1 SD_LED.A
PA12: R25.1 U$1.CD1(CARD_DETECT) ; also sheet 3
SD_DATA_OUT: R22.2 R24.1 U$1.7(DATA_OUT)
VCC_MMC: C53.1 C54.+ L1.2 R23.2 R24.2 R25.2 U$1.4(VDD)
Unconnected: R29.2 U$1.1(DAT2) U$1.8(DAT1)

## Sheet 7 of 10: TFT & Touch
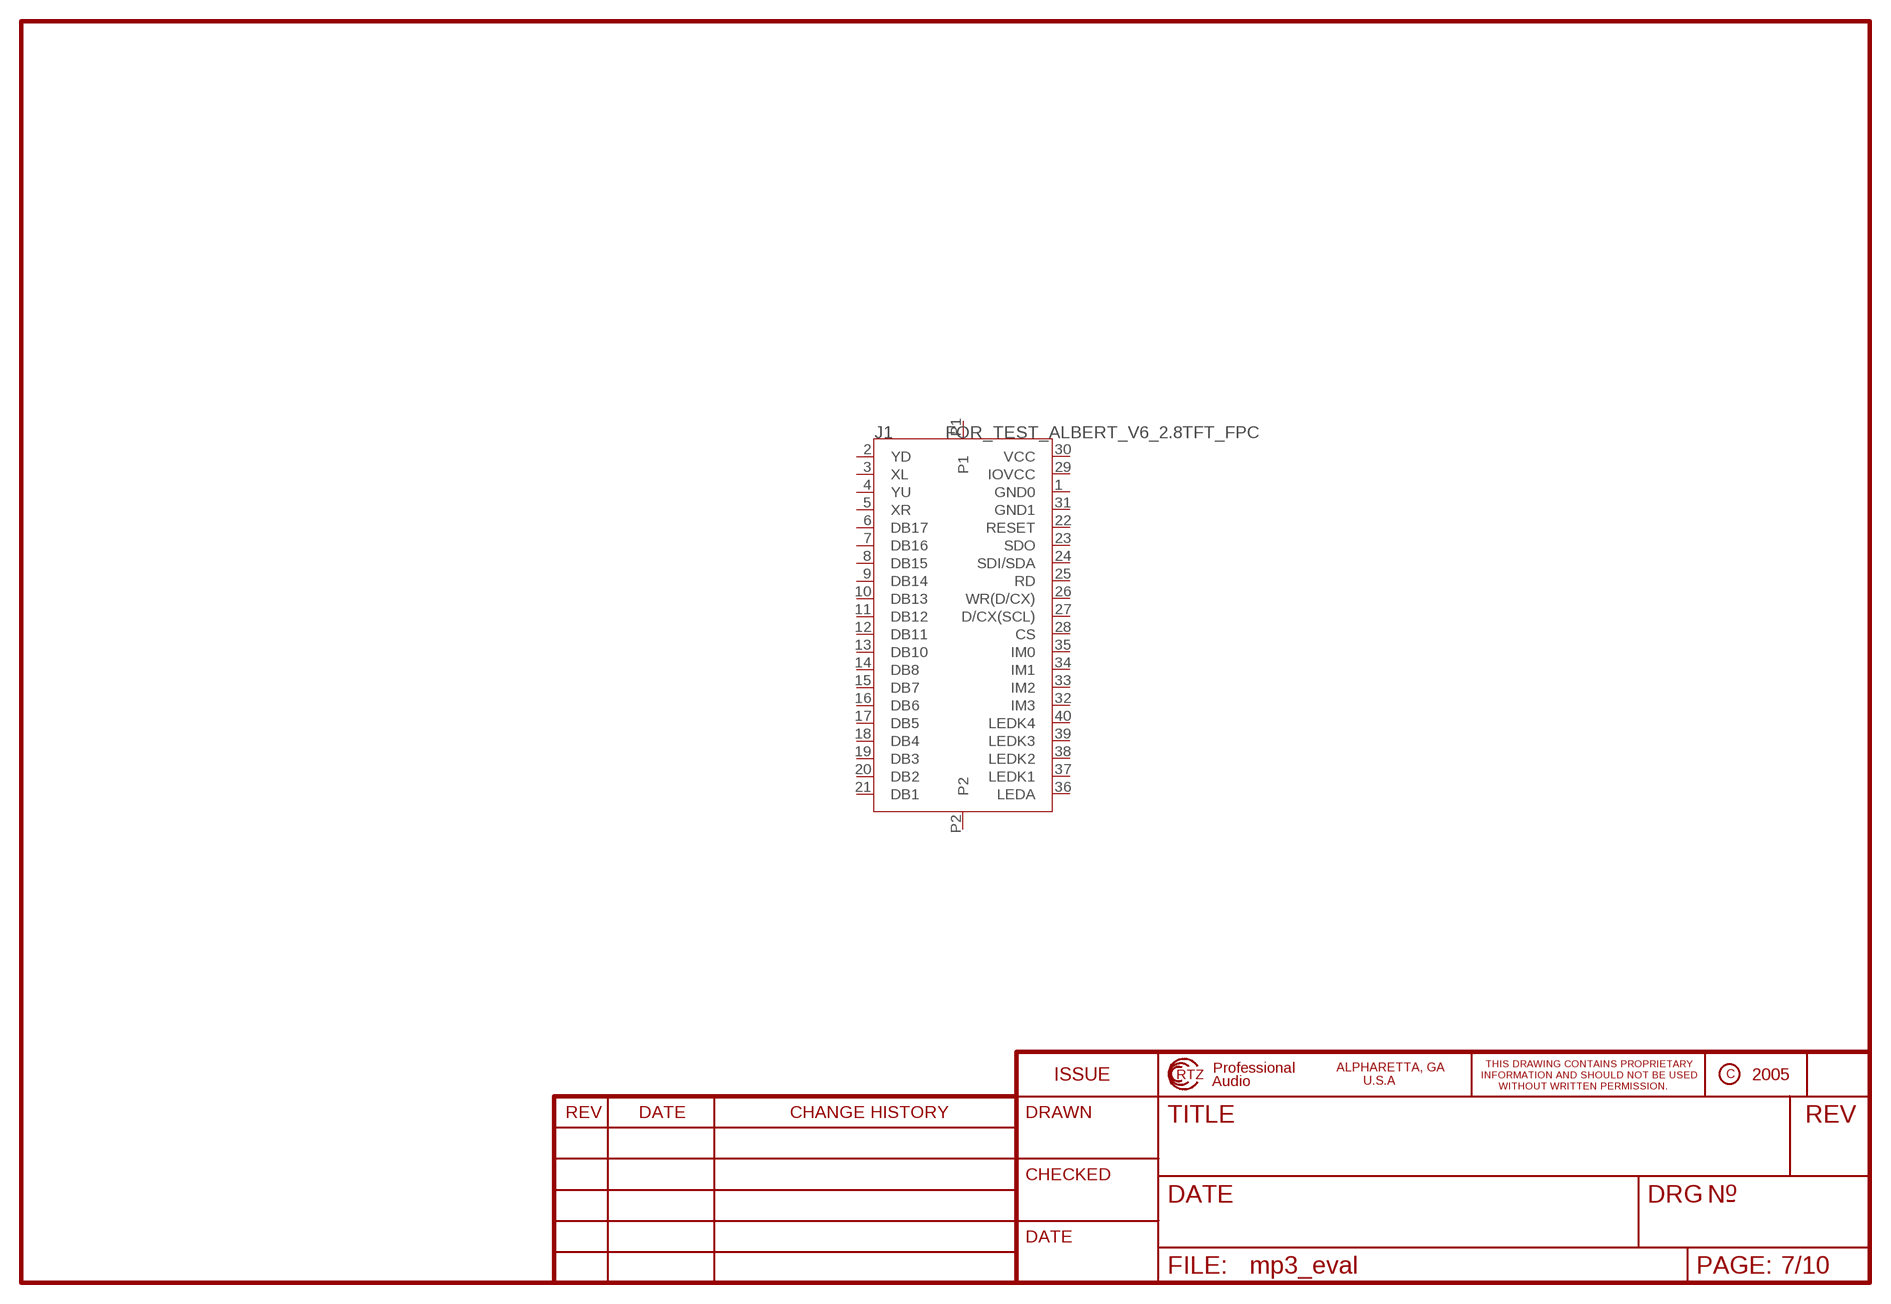
[diagram p6: schematic, sheet 7]

### Parts
J1  FOR_TEST_ALBERT_V6_2.8TFT_FPC  [FOR_TEST_ALBERT_V6_2.8TFT_FFC]
Unconnected: J1.1(GND0) J1.2(YD) J1.3(XL) J1.4(YU) J1.5(XR) J1.6(DB17) J1.7(DB16) J1.8(DB15) J1.9(DB14) J1.10(DB13) J1.11(DB12) J1.12(DB11) J1.13(DB10) J1.14(DB8) J1.15(DB7) J1.16(DB6) J1.17(DB5) J1.18(DB4) J1.19(DB3) J1.20(DB2) J1.21(DB1) J1.22(RESET) J1.23(SDO) J1.24(SDI/SDA) J1.25(RD) J1.26(WR(D/CX)) J1.27(D/CX(SCL)) J1.28(CS) J1.29(IOVCC) J1.30(VCC) J1.31(GND1) J1.32(IM3) J1.33(IM2) J1.34(IM1) J1.35(IM0) J1.36(LEDA) J1.37(LEDK1) J1.38(LEDK2) J1.39(LEDK3) J1.40(LEDK4) J1.P1 J1.P2

## Sheet 8 of 10: Gyro
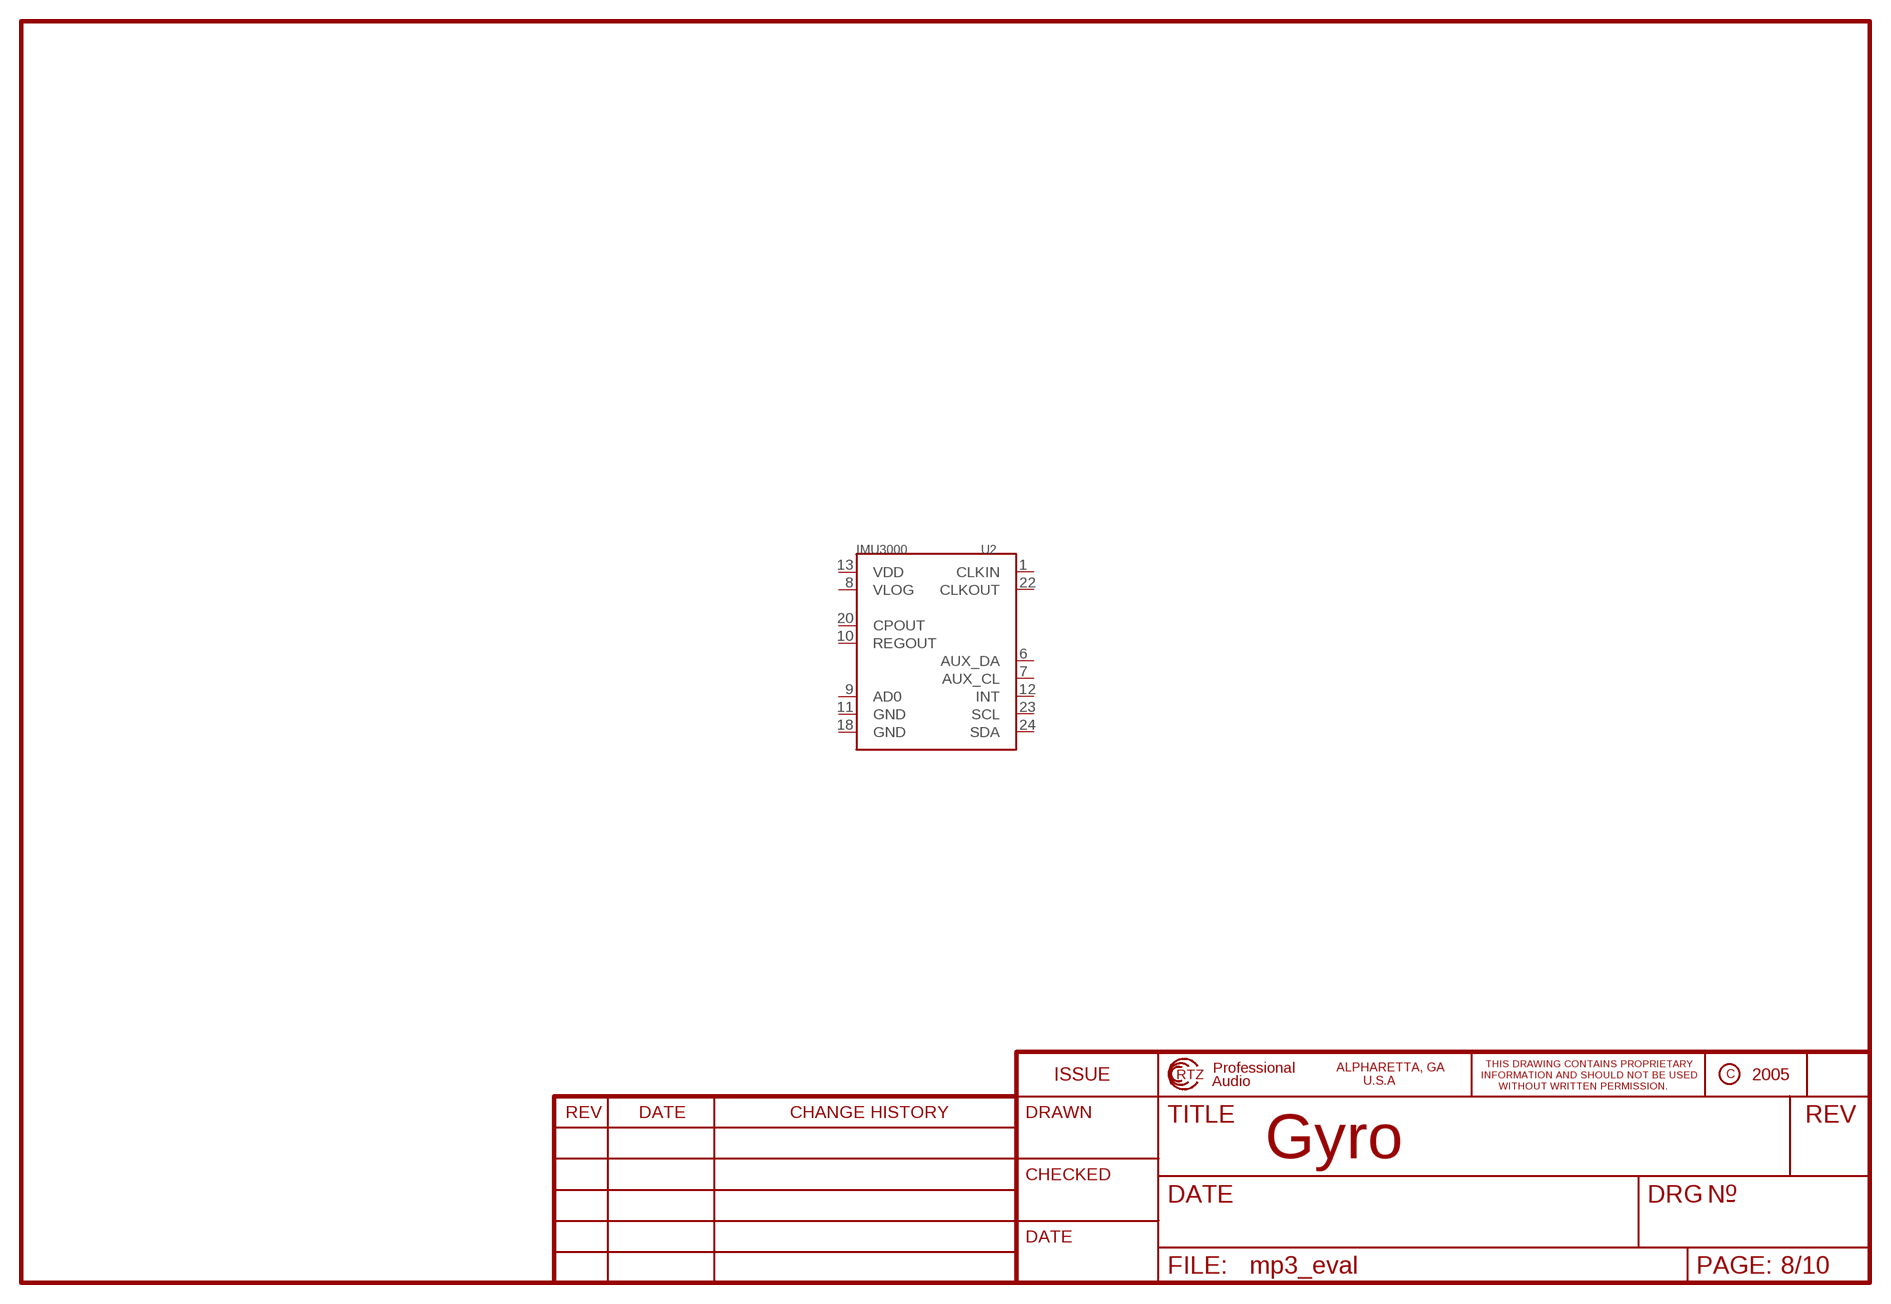
[diagram p7: schematic, sheet 8]

### Parts
U2  IMU3000  [QFN-24]
Unconnected: U2.1(CLKIN) U2.6(AUX_DA) U2.7(AUX_CL) U2.8(VLOG) U2.9(AD0) U2.10(REGOUT) U2.11(GND) U2.12(INT) U2.13(VDD) U2.18(GND) U2.20(CPOUT) U2.22(CLKOUT) U2.23(SCL) U2.24(SDA)

### Notes on the sheet
- Gyro

## Sheet 9 of 10: FTDI
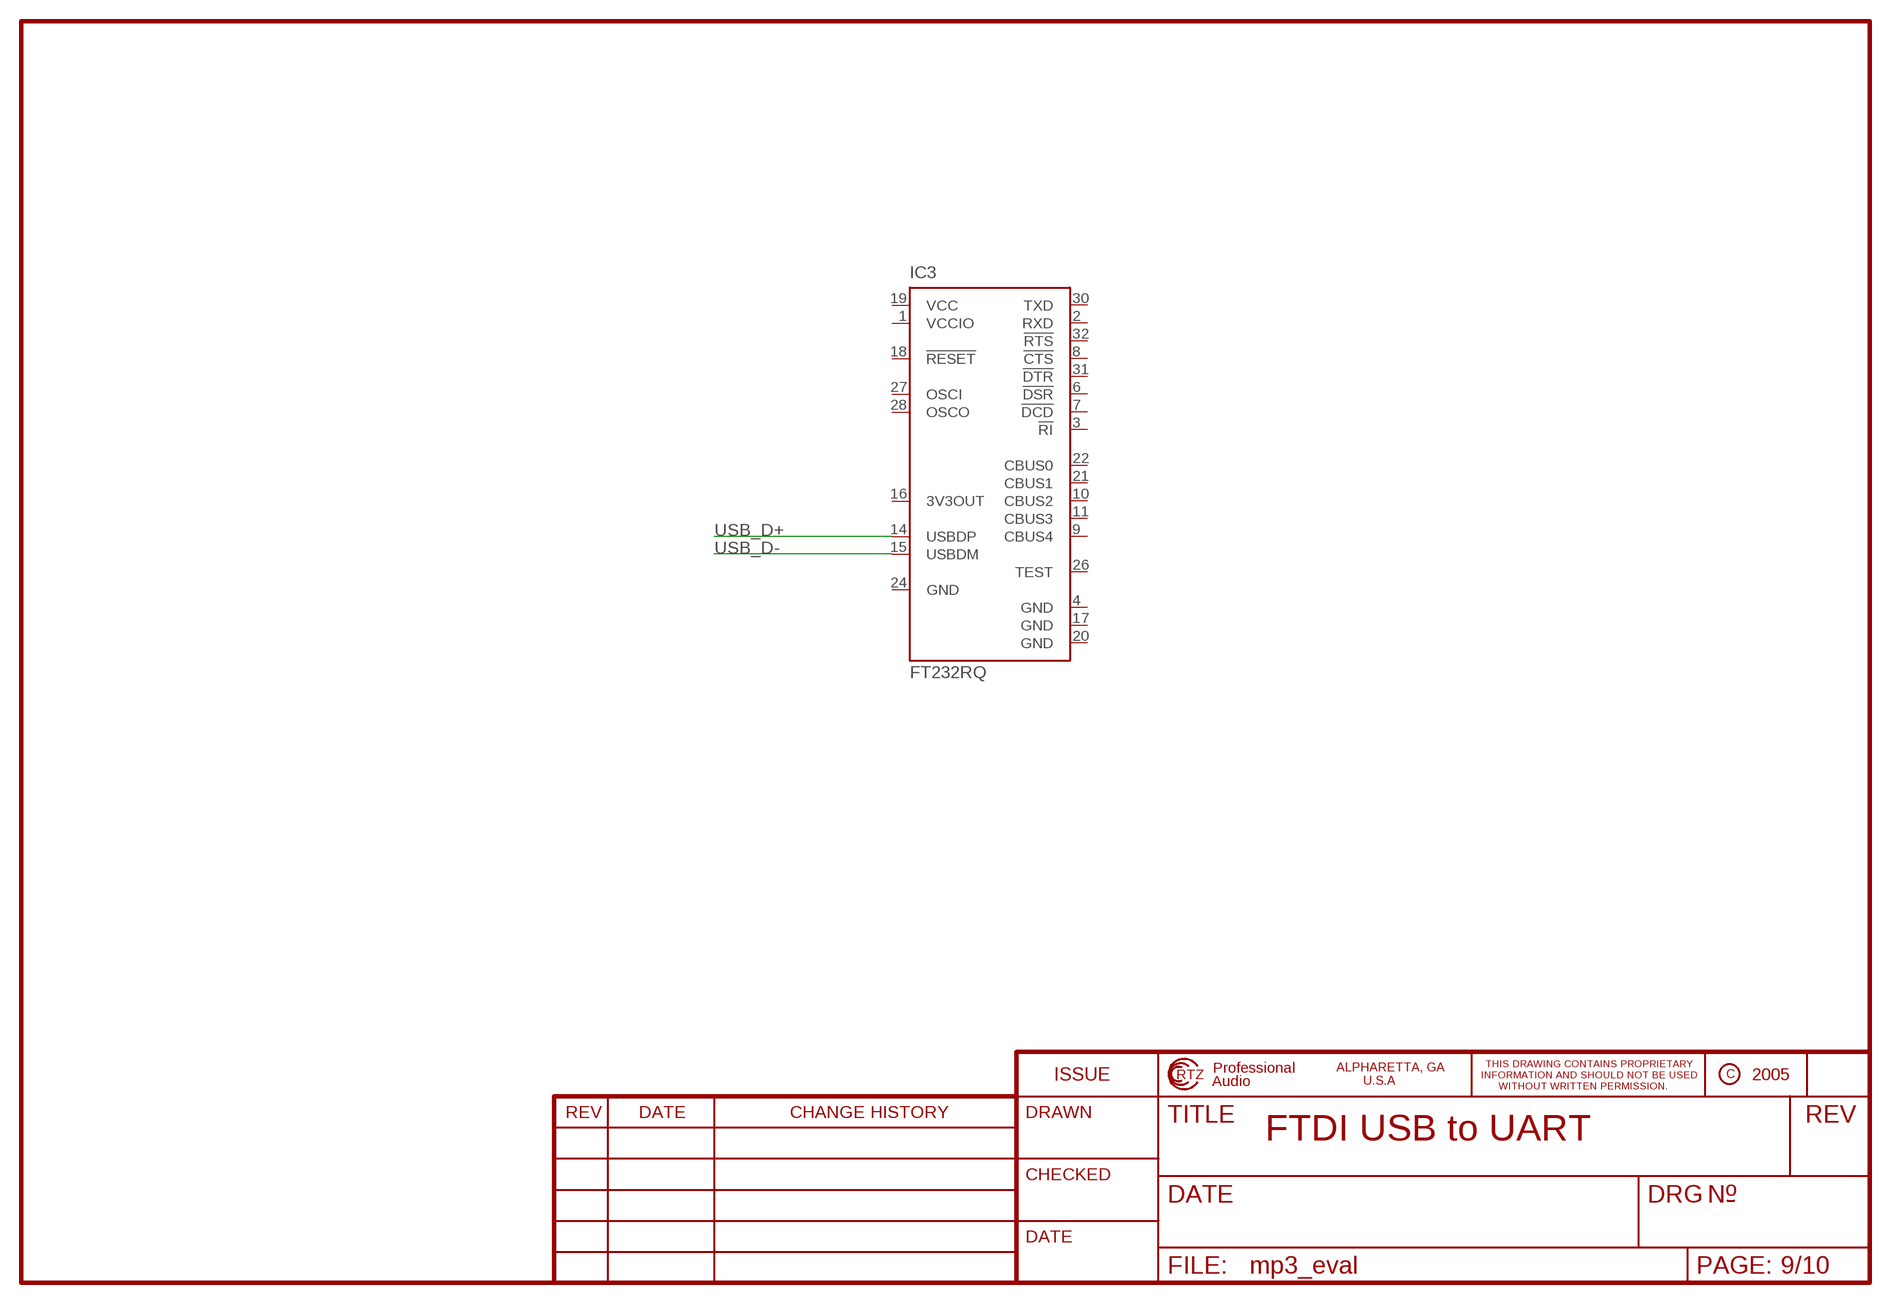
[diagram p8: schematic, sheet 9]

### Parts
IC3  FT232RQ  [QFN32]

### Nets
USB_D+: IC3.14(USBDP) ; also sheet 1
USB_D-: IC3.15(USBDM) ; also sheet 1
Unconnected: IC3.2(RXD) IC3.3(!RI) IC3.6(!DSR) IC3.7(!DCD) IC3.8(!CTS) IC3.9(CBUS4) IC3.10(CBUS2) IC3.11(CBUS3) IC3.16(3V3OUT) IC3.18(!RESET) IC3.21(CBUS1) IC3.22(CBUS0) IC3.26(TEST) IC3.27(OSCI) IC3.28(OSCO) IC3.30(TXD) IC3.31(!DTR) IC3.32(!RTS)

### Notes on the sheet
- FTDI USB to UART

## Sheet 10 of 10: Prox/Ambient Sensor
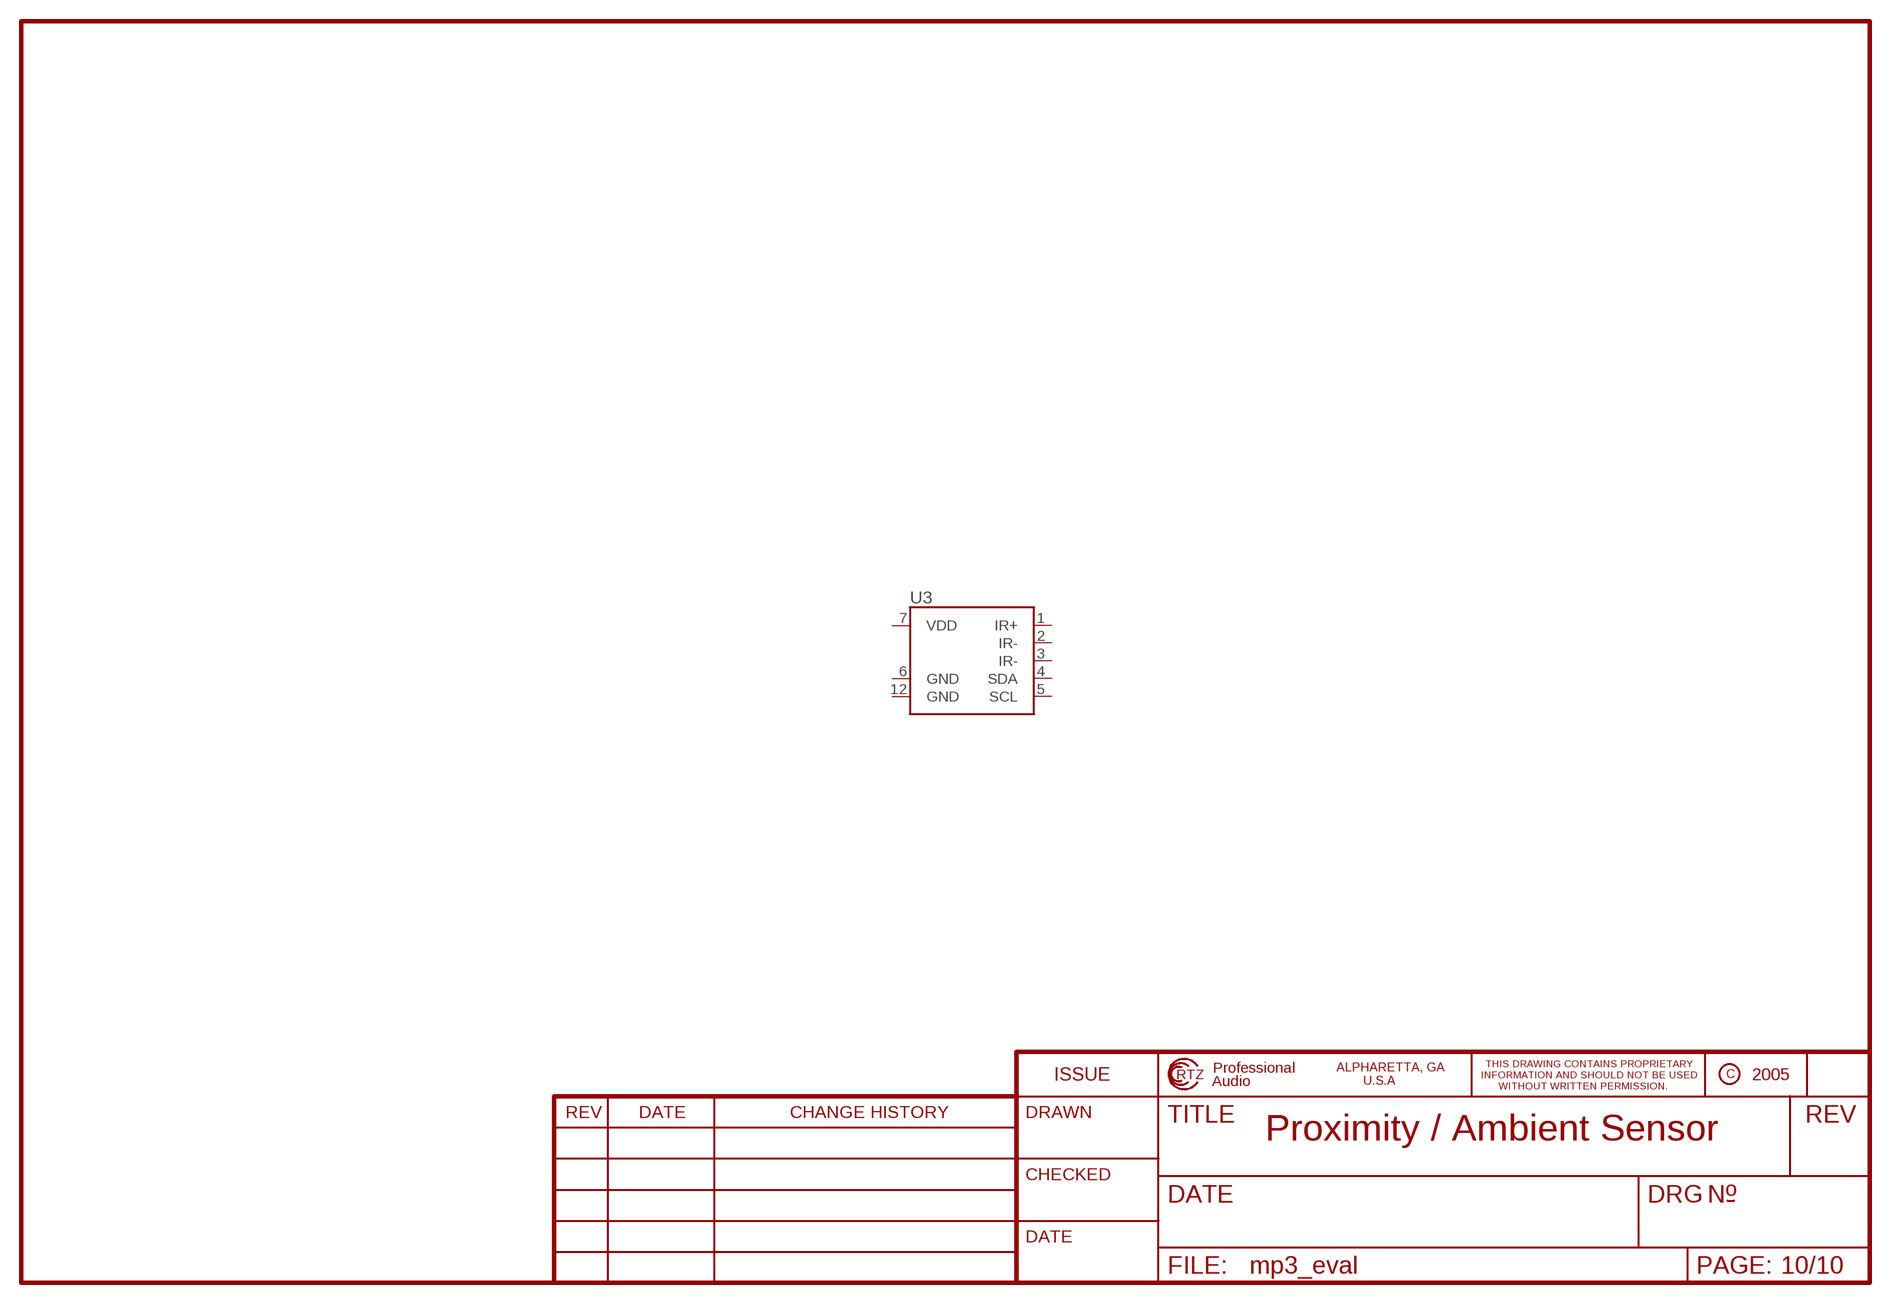
[diagram p9: schematic, sheet 10]

### Parts
U3  VCNL4000  [VCNL4000]
Unconnected: U3.1(IR+) U3.2(IR-) U3.3(IR-) U3.4(SDA) U3.5(SCL) U3.6(GND) U3.7(VDD) U3.12(GND)

### Notes on the sheet
- Proximity / Ambient Sensor

## Power pins joined to a net without a drawn wire
GND: IC3.4(GND) IC3.17(GND) IC3.20(GND) IC3.24(GND)
PDR_ON: IC1.171(PDR_ON)
VCAP_1: IC1.81(VCAP_1)
VCAP_2: IC1.125(VCAP_2)
VCC: IC3.19(VCC)
VCCIO: IC3.1(VCCIO)
VREF+: IC1.38(VREF+)

## Library data of the parts
1V8_LDO 2V8_LDO 3V3_LDO = SparkFun-PowerIC:V_REG_LDO: Voltage Regulator LDO Standard 150mA LDO voltage regulator in SOT-23 layout. Micrel part MIC5205. BP (by-pass) pin is used to lower output noise with 470pF cap.
C1 C2 = resistor:C-EU: CAPACITOR, European symbol
C3_3V3_LDO C5_2V8_LDO C7_1V8_LDO C54 = dp_devices:CAPACITOR_POL: Polarized capacitor in various packages
C4_3V3_LDO C6_2V8_LDO C8_1V8_LDO = rcl:C-US: CAPACITOR, American symbol
C9-C53 C55_VBAT = rcl:C-EU: CAPACITOR, European symbol
IC1 = STM32F439IIT:STM32F439IIT: edit this description Auto generated by make-symbol-device-package-bsdl.ulp Rev. 43 Source:
IC2 = IS42S16400J:IS42S16400J: edit this description Auto generated by make-symbol-device-package-bsdl.ulp Rev. 43 Source:
IC3 = ftdichip:FT232R: Source: http://www.ftdichip.com/Documents/DataSheets/DS_FT232R_v104.pdf; MPN: FT232RQ; OC_FARNELL: 1146033; OC_NEWARK: 91K9919
J1 = TFT Touch:FOR_TEST_ALBERT_V6_2.8TFT_FPC
JP1 JP2 JP4 JP5 = pinhead:PINHD-2X20: PIN HEADER
L1 = dp_devices:FERRITE: Ferrite bead in various packages
PWR_LED = led:LED: LED
Q1_STM Q2 = crystal:CRYSTAL: CRYSTAL; OC_FARNELL: unknown; OC_NEWARK: unknown
R1 R2 R2_PWR_LED R3-R29 = SparkFun-Passives:RESISTOR: Resistor Basic schematic elements and footprints for 0603, 1206, and PTH resistors.
S1_RST S2_USR_WKP = SparkFun-Electromechanical:SWITCH-MOMENTARY-2: Various NO switches- pushbuttons, reed, etc
SD_LED = dp_devices:LED: Light Emitting Diode
U1 = vlsi-web:VS1063: MP3 / OGG / AAC / WMA / FLAC / G.711 / G.722 Audio Codec
U2 = SparkFun-Sensors:IMU3000: 3-axis I2C programmable gyro. Can interface with an I2C accelerometer to provide 6-axis motion information.
U3 = SparkFun-Sensors:VCNL4000: Fully integrated proximity and ambient light sensor with infrared emitter and I2C interface
U$1 = adafruit:MICROSD: Micro-SD / Transflash card holder with SPI pinout For the 3M # 2908-05WB-MG and/or 4UCON #19656 push-push type
USR_LED1-USR_LED4 = adafruit:LED: LED
X1 = con-hirose:MINI-USB-: MINI USB Connector Source: http://www.hirose.co.jp/cataloge_hp/e24000019.pdf; OC_FARNELL: unknown; OC_NEWARK: unknown
X2 = adafruit:STEREOJACK: MIC/HEADPHONE JACK Stereo jack with two switches. Kycon STX3100, CUI SJ1-3555NG and/or 4UCon 05544

## Board
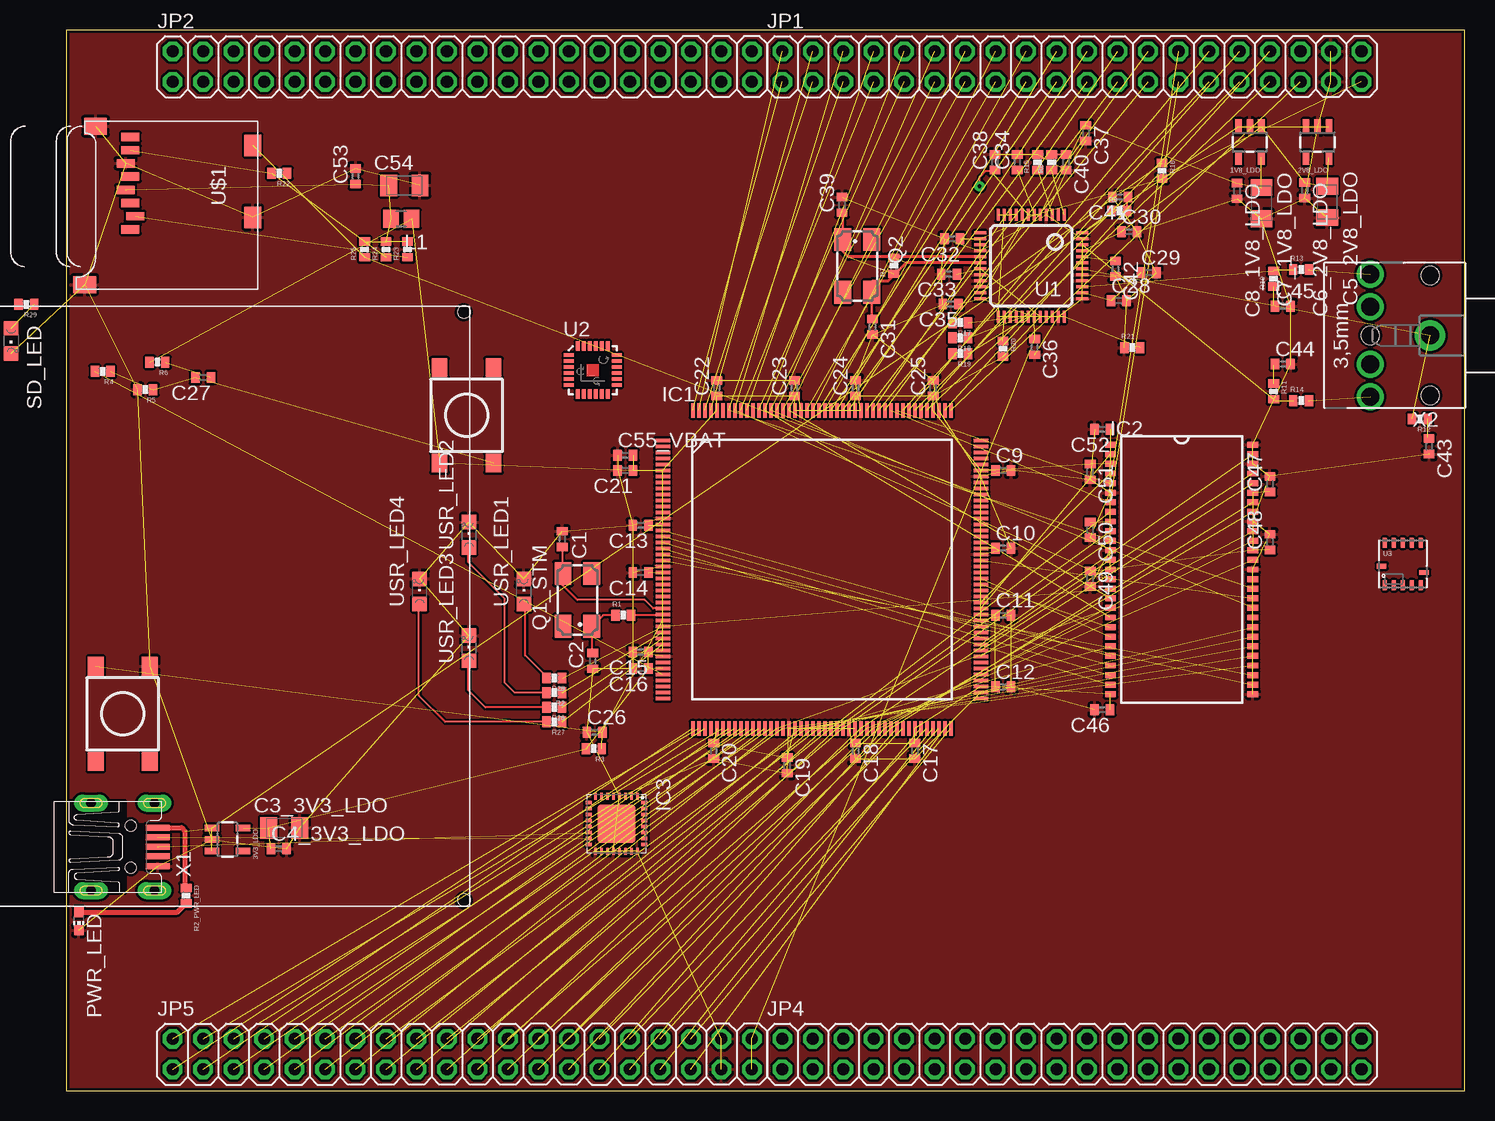
[diagram p10: board, top side]
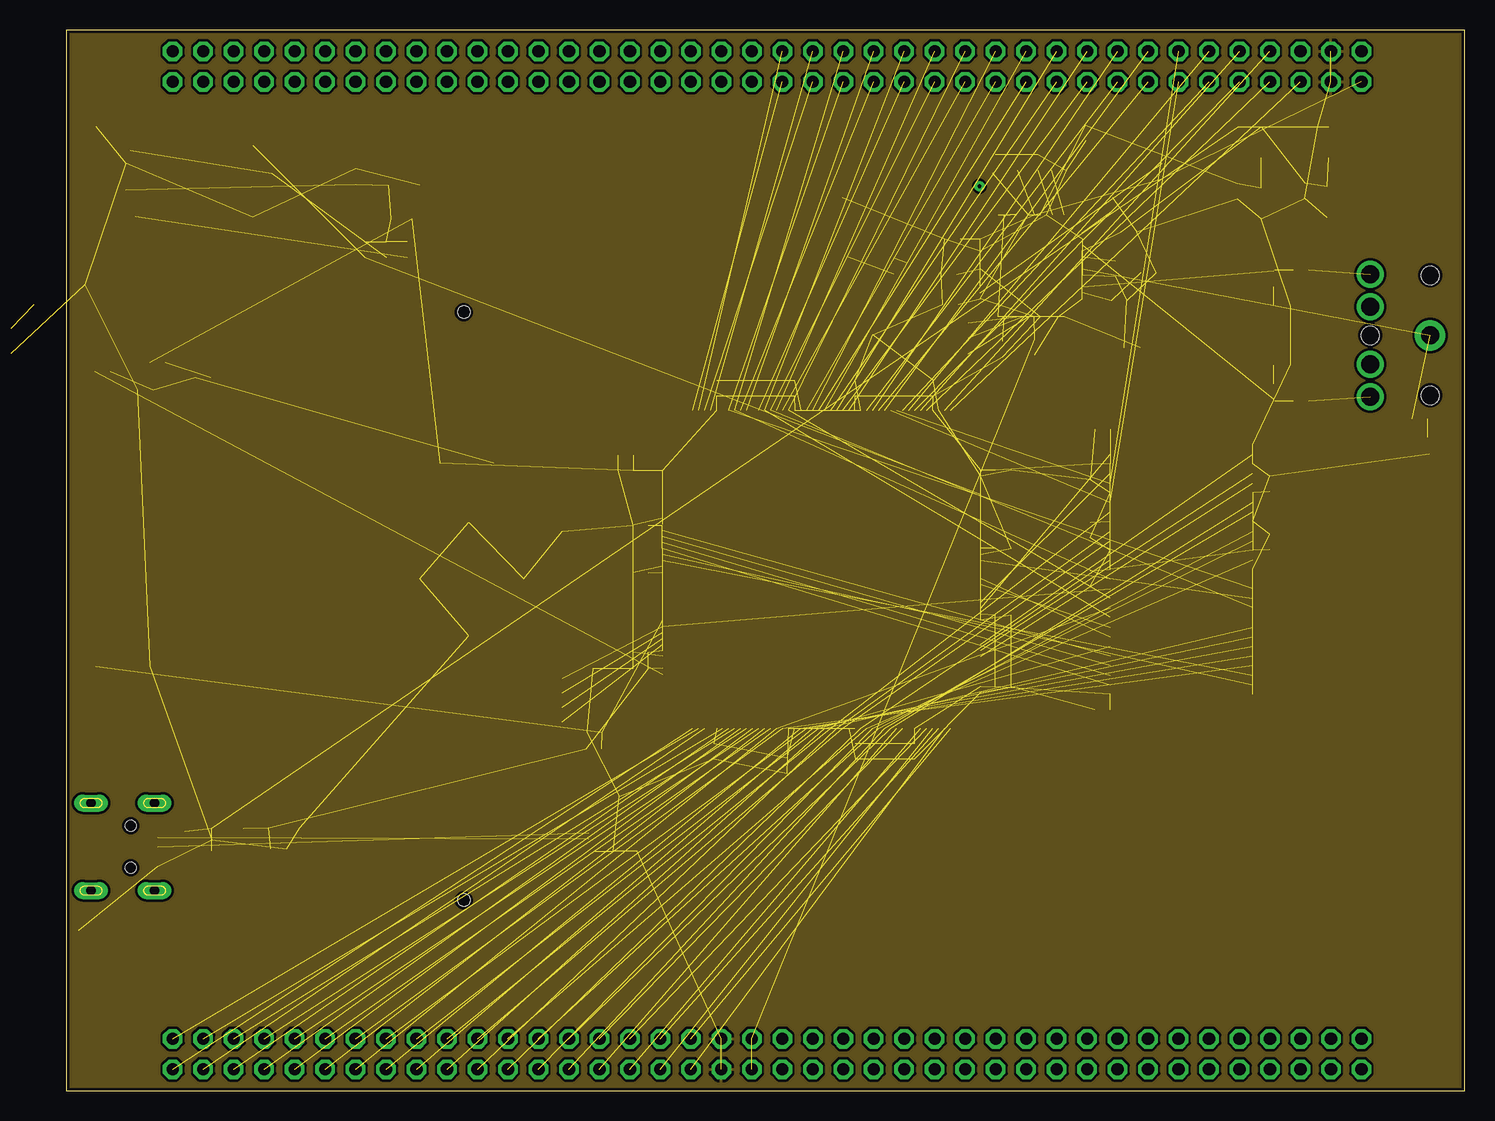
[diagram p11: board, inner layer Route2]
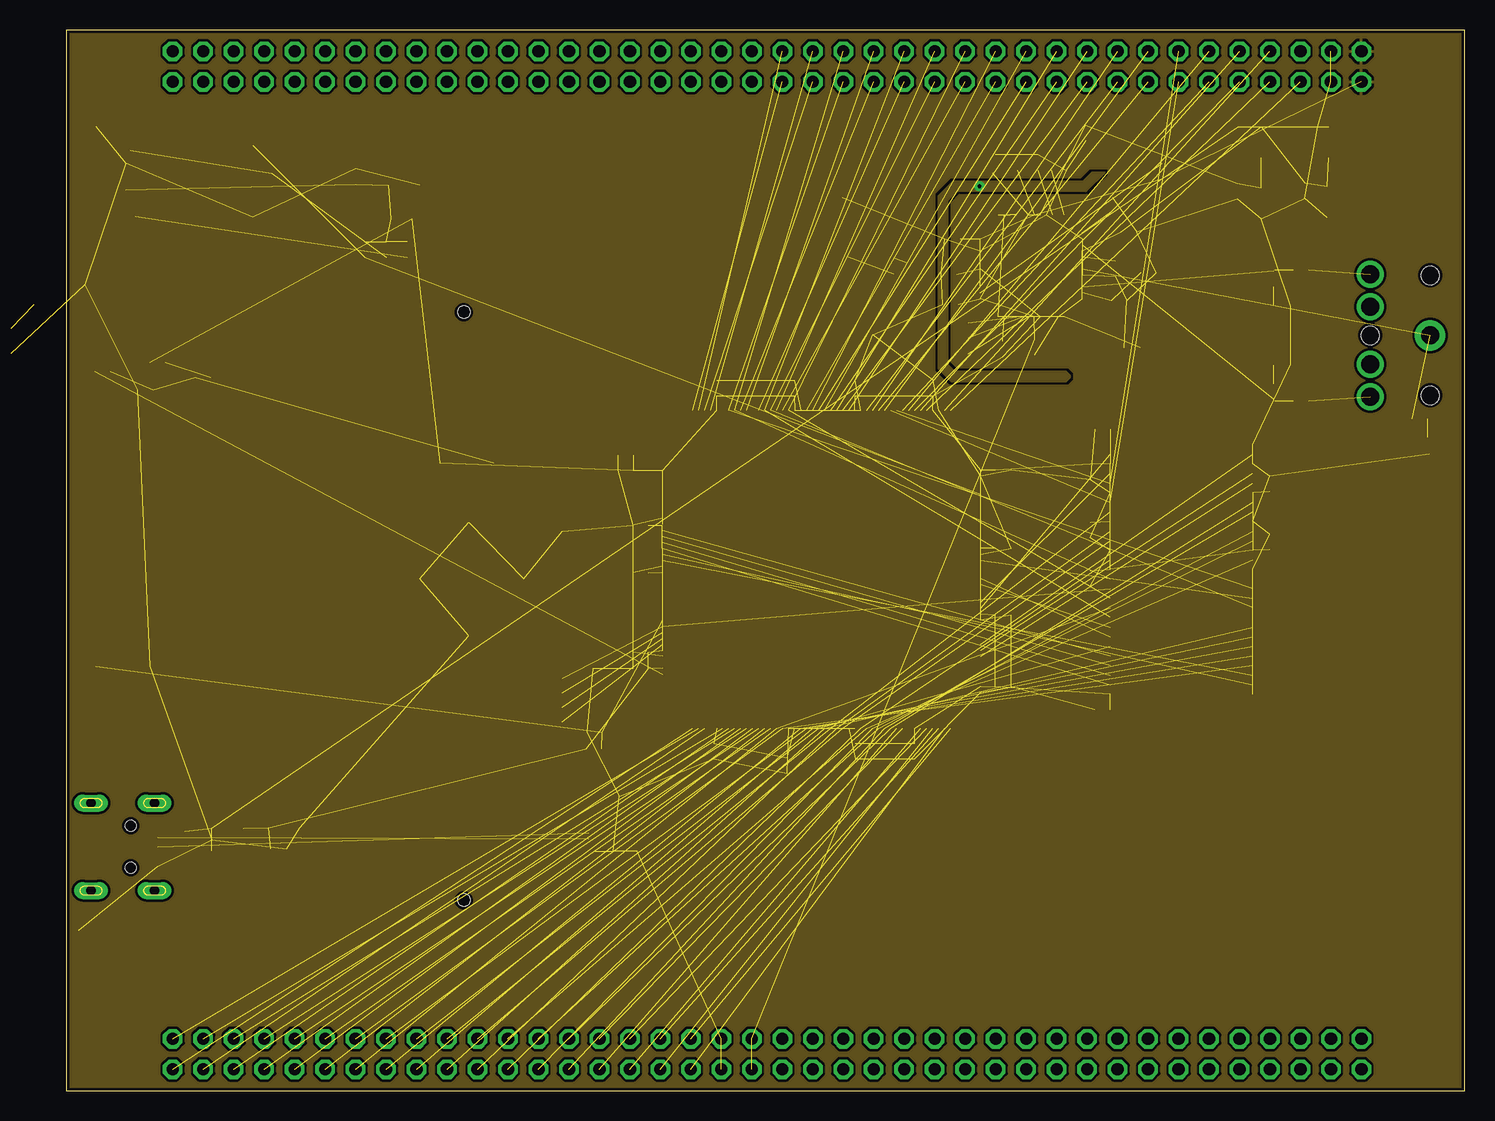
[diagram p12: board, inner layer Route3]
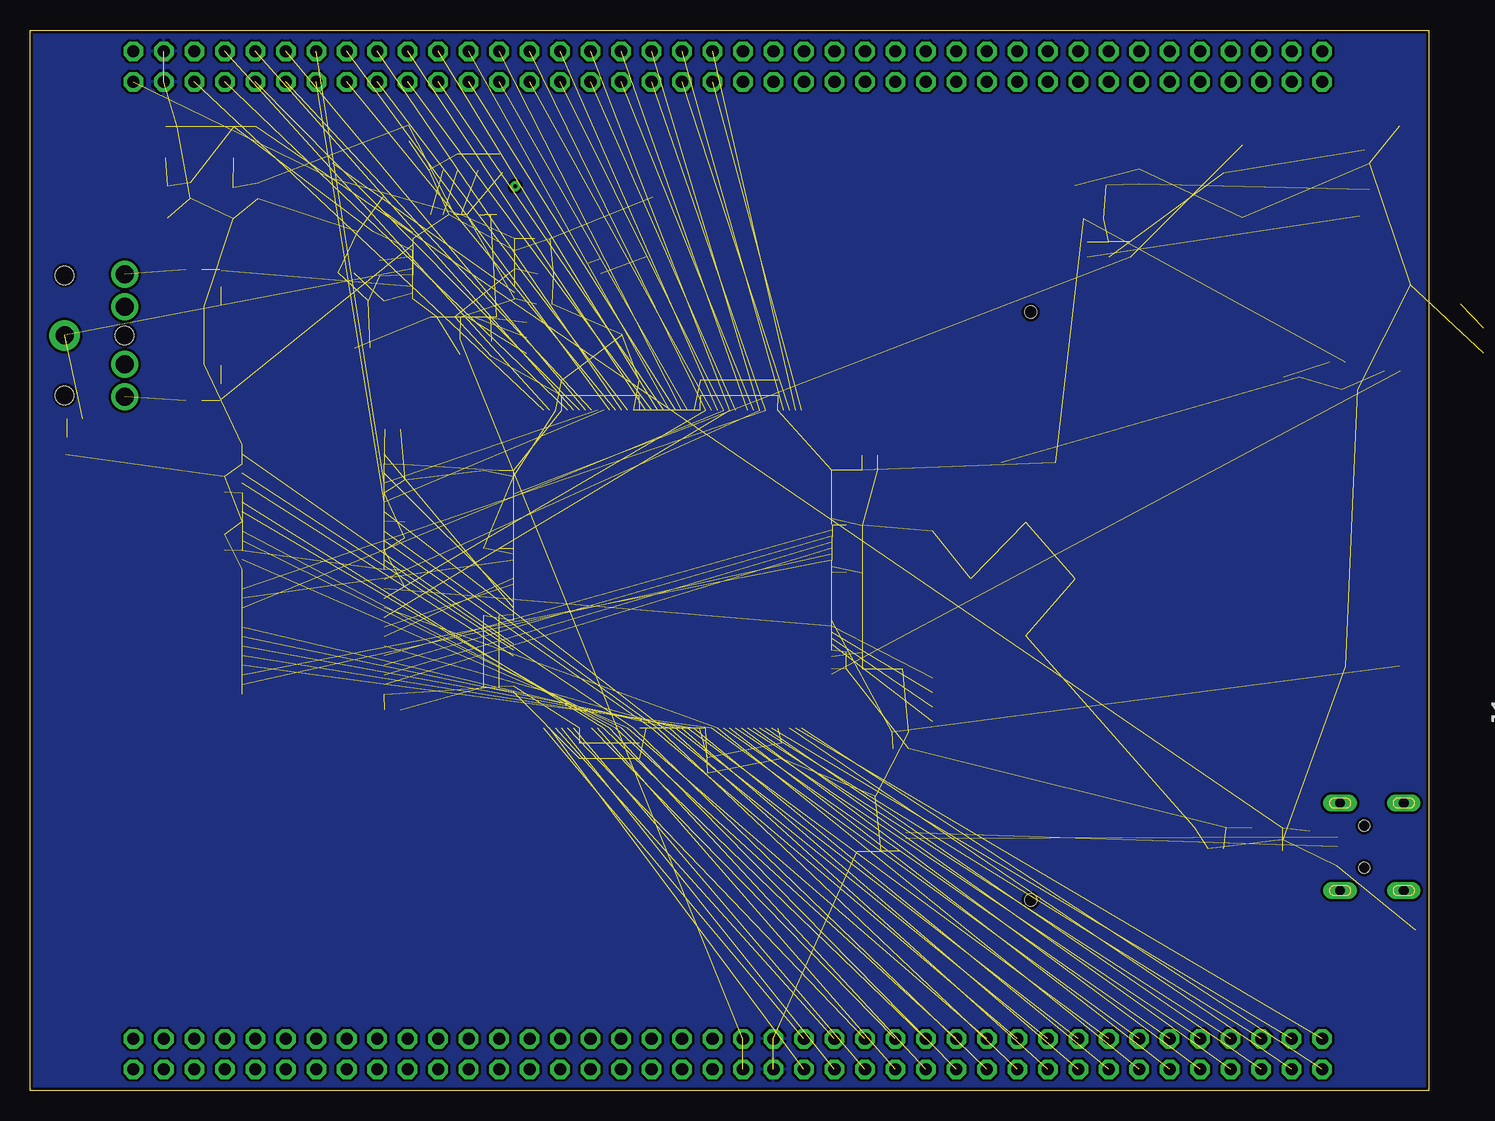
[diagram p13: board, bottom side, seen from below]

Size 116.57 x 88.39 mm. Coordinates in mm from the lower left corner, seen from the top.
Outline: 0,0 116.57,0 116.57,88.39 0,88.39 0,0
Copper layers (1*16): Top 0.035mm / dielectric 1.5mm / Bottom 0.035mm
Design rules "SparkFun": minimum track width 8mil, minimum drill 20mil, track to track 8mil, track to pad 8mil, pad to pad 8mil, via to via 8mil, smd to smd 8mil, copper to edge 10mil, drill to drill 8mil, minimum pad ring 12mil, minimum via ring 10mil, stop-mask expansion 4mil, vias tented up to drill 25mil, thermal gap 10mil

### Footprints (pad centres in the part's own frame; a part is rotated, then mirrored left to right if it is on the bottom)
SOT23-5 = smd 0.55 x 1.2: 1 -0.95,-1.3; 2 0,-1.3; 3 0.95,-1.3; 4 0.95,1.3; 5 -0.95,1.3
C0402 = smd 0.7 x 0.9: 1 -0.65,0; 2 0.65,0
SMC_A = smd 1.4 x 1.8: + -1.3,0; - 1.3,0
LQFP-176 = smd 1.2 x 0.3: 1 -13.25,10.75; 2 -13.25,10.25; 3 -13.25,9.75; 4 -13.25,9.25; 5 -13.25,8.75; 6 -13.25,8.25; 7 -13.25,7.75; 8 -13.25,7.25; 9 -13.25,6.75; 10 -13.25,6.25; 11 -13.25,5.75; 12 -13.25,5.25; 13 -13.25,4.75; 14 -13.25,4.25; 15 -13.25,3.75; 16 -13.25,3.25; 17 -13.25,2.75; 18 -13.25,2.25; 19 -13.25,1.75; 20 -13.25,1.25; 21 -13.25,0.75; 22 -13.25,0.25; 23 -13.25,-0.25; 24 -13.25,-0.75; 25 -13.25,-1.25; 26 -13.25,-1.75; 27 -13.25,-2.25; 28 -13.25,-2.75; 29 -13.25,-3.25; 30 -13.25,-3.75; 31 -13.25,-4.25; 32 -13.25,-4.75; 33 -13.25,-5.25; 34 -13.25,-5.75; 35 -13.25,-6.25; 36 -13.25,-6.75; 37 -13.25,-7.25; 38 -13.25,-7.75; 39 -13.25,-8.25; 40 -13.25,-8.75; 41 -13.25,-9.25; 42 -13.25,-9.75; 43 -13.25,-10.25; 44 -13.25,-10.75; 89 13.25,-10.75; 90 13.25,-10.25; 91 13.25,-9.75; 92 13.25,-9.25; 93 13.25,-8.75; 94 13.25,-8.25; 95 13.25,-7.75; 96 13.25,-7.25; 97 13.25,-6.75; 98 13.25,-6.25; 99 13.25,-5.75; 100 13.25,-5.25; 101 13.25,-4.75; 102 13.25,-4.25; 103 13.25,-3.75; 104 13.25,-3.25; 105 13.25,-2.75; 106 13.25,-2.25; 107 13.25,-1.75; 108 13.25,-1.25; 109 13.25,-0.75; 110 13.25,-0.25; 111 13.25,0.25; 112 13.25,0.75; 113 13.25,1.25; 114 13.25,1.75; 115 13.25,2.25; 116 13.25,2.75; 117 13.25,3.25; 118 13.25,3.75; 119 13.25,4.25; 120 13.25,4.75; 121 13.25,5.25; 122 13.25,5.75; 123 13.25,6.25; 124 13.25,6.75; 125 13.25,7.25; 126 13.25,7.75; 127 13.25,8.25; 128 13.25,8.75; 129 13.25,9.25; 130 13.25,9.75; 131 13.25,10.25; 132 13.25,10.75 | smd 0.3 x 1.2: 45 -10.75,-13.25; 46 -10.25,-13.25; 47 -9.75,-13.25; 48 -9.25,-13.25; 49 -8.75,-13.25; 50 -8.25,-13.25; 51 -7.75,-13.25; 52 -7.25,-13.25; 53 -6.75,-13.25; 54 -6.25,-13.25; 55 -5.75,-13.25; 56 -5.25,-13.25; 57 -4.75,-13.25; 58 -4.25,-13.25; 59 -3.75,-13.25; 60 -3.25,-13.25; 61 -2.75,-13.25; 62 -2.25,-13.25; 63 -1.75,-13.25; 64 -1.25,-13.25; 65 -0.75,-13.25; 66 -0.25,-13.25; 67 0.25,-13.25; 68 0.75,-13.25; 69 1.25,-13.25; 70 1.75,-13.25; 71 2.25,-13.25; 72 2.75,-13.25; 73 3.25,-13.25; 74 3.75,-13.25; 75 4.25,-13.25; 76 4.75,-13.25; 77 5.25,-13.25; 78 5.75,-13.25; 79 6.25,-13.25; 80 6.75,-13.25; 81 7.25,-13.25; 82 7.75,-13.25; 83 8.25,-13.25; 84 8.75,-13.25; 85 9.25,-13.25; 86 9.75,-13.25; 87 10.25,-13.25; 88 10.75,-13.25; 133 10.75,13.25; 134 10.25,13.25; 135 9.75,13.25; 136 9.25,13.25; 137 8.75,13.25; 138 8.25,13.25; 139 7.75,13.25; 140 7.25,13.25; 141 6.75,13.25; 142 6.25,13.25; 143 5.75,13.25; 144 5.25,13.25; 145 4.75,13.25; 146 4.25,13.25; 147 3.75,13.25; 148 3.25,13.25; 149 2.75,13.25; 150 2.25,13.25; 151 1.75,13.25; 152 1.25,13.25; 153 0.75,13.25; 154 0.25,13.25; 155 -0.25,13.25; 156 -0.75,13.25; 157 -1.25,13.25; 158 -1.75,13.25; 159 -2.25,13.25; 160 -2.75,13.25; 161 -3.25,13.25; 162 -3.75,13.25; 163 -4.25,13.25; 164 -4.75,13.25; 165 -5.25,13.25; 166 -5.75,13.25; 167 -6.25,13.25; 168 -6.75,13.25; 169 -7.25,13.25; 170 -7.75,13.25; 171 -8.25,13.25; 172 -8.75,13.25; 173 -9.25,13.25; 174 -9.75,13.25; 175 -10.25,13.25; 176 -10.75,13.25
TSOP-2 = smd 0.9 x 0.49: 1 -5.93,10.4; 2 -5.93,9.6; 3 -5.93,8.8; 4 -5.93,8; 5 -5.93,7.2; 6 -5.93,6.4; 7 -5.93,5.6; 8 -5.93,4.8; 9 -5.93,4; 10 -5.93,3.2; 11 -5.93,2.4; 12 -5.93,1.6; 13 -5.93,0.8; 14 -5.93,0; 15 -5.93,-0.8; 16 -5.93,-1.6; 17 -5.93,-2.4; 18 -5.93,-3.2; 19 -5.93,-4; 20 -5.93,-4.8; 21 -5.93,-5.6; 22 -5.93,-6.4; 23 -5.93,-7.2; 24 -5.93,-8; 25 -5.93,-8.8; 26 -5.93,-9.6; 27 -5.93,-10.4; 28 5.93,-10.4; 29 5.93,-9.6; 30 5.93,-8.8; 31 5.93,-8; 32 5.93,-7.2; 33 5.93,-6.4; 34 5.93,-5.6; 35 5.93,-4.8; 36 5.93,-4; 37 5.93,-3.2; 38 5.93,-2.4; 39 5.93,-1.6; 40 5.93,-0.8; 41 5.93,0; 42 5.93,0.8; 43 5.93,1.6; 44 5.93,2.4; 45 5.93,3.2; 46 5.93,4; 47 5.93,4.8; 48 5.93,5.6; 49 5.93,6.4; 50 5.93,7.2; 51 5.93,8; 52 5.93,8.8; 53 5.93,9.6; 54 5.93,10.4
QFN32 = smd 0.6 x 0.3: 1 -2.3,1.75; 2 -2.3,1.25; 3 -2.3,0.75; 4 -2.3,0.25; 5 -2.3,-0.25; 6 -2.3,-0.75; 7 -2.3,-1.25; 8 -2.3,-1.75; 17 2.3,-1.75; 18 2.3,-1.25; 19 2.3,-0.75; 20 2.3,-0.25; 21 2.3,0.25; 22 2.3,0.75; 23 2.3,1.25; 24 2.3,1.75 | smd 0.3 x 0.6: 9 -1.75,-2.3; 10 -1.25,-2.3; 11 -0.75,-2.3; 12 -0.25,-2.3; 13 0.25,-2.3; 14 0.75,-2.3; 15 1.25,-2.3; 16 1.75,-2.3; 25 1.75,2.3; 26 1.25,2.3; 27 0.75,2.3; 28 0.25,2.3; 29 -0.25,2.3; 30 -0.75,2.3; 31 -1.25,2.3; 32 -1.75,2.3 | smd 3.2 x 3.2: EXP 0,0
FOR_TEST_ALBERT_V6_2.8TFT_FFC = smd 0.305 x 1.524 bottom: 1 -9.75,3.81; 2 -9.25,3.81; 3 -8.75,3.81; 4 -8.25,3.81; 5 -7.75,3.81; 6 -7.25,3.81; 7 -6.75,3.81; 8 -6.25,3.81; 9 -5.75,3.81; 10 -5.25,3.81; 11 -4.75,3.81; 12 -4.25,3.81; 13 -3.75,3.81; 14 -3.25,3.81; 15 -2.75,3.81; 16 -2.25,3.81; 17 -1.75,3.81; 18 -1.25,3.81; 19 -0.75,3.81; 20 -0.25,3.81; 21 0.25,3.81; 22 0.75,3.81; 23 1.25,3.81; 24 1.75,3.81; 25 2.25,3.81; 26 2.75,3.81; 27 3.25,3.81; 28 3.75,3.81; 29 4.25,3.81; 30 4.75,3.81; 31 5.25,3.81; 32 5.75,3.81; 33 6.25,3.81; 34 6.75,3.81; 35 7.25,3.81; 36 7.75,3.81; 37 8.25,3.81; 38 8.75,3.81; 39 9.25,3.81; 40 9.75,3.81 | smd 2.286 x 2.286 bottom: P1 -11.811,0.635; P2 11.811,0.635 | hole 1: -24.5,45.2; -24.5,-23; 24.5,-23; 24.5,45.2
2X20 = drill 1.016 octagon: 1 -24.13,-1.27; 2 -24.13,1.27; 3 -21.59,-1.27; 4 -21.59,1.27; 5 -19.05,-1.27; 6 -19.05,1.27; 7 -16.51,-1.27; 8 -16.51,1.27; 9 -13.97,-1.27; 10 -13.97,1.27; 11 -11.43,-1.27; 12 -11.43,1.27; 13 -8.89,-1.27; 14 -8.89,1.27; 15 -6.35,-1.27; 16 -6.35,1.27; 17 -3.81,-1.27; 18 -3.81,1.27; 19 -1.27,-1.27; 20 -1.27,1.27; 21 1.27,-1.27; 22 1.27,1.27; 23 3.81,-1.27; 24 3.81,1.27; 25 6.35,-1.27; 26 6.35,1.27; 27 8.89,-1.27; 28 8.89,1.27; 29 11.43,-1.27; 30 11.43,1.27; 31 13.97,-1.27; 32 13.97,1.27; 33 16.51,-1.27; 34 16.51,1.27; 35 19.05,-1.27; 36 19.05,1.27; 37 21.59,-1.27; 38 21.59,1.27; 39 24.13,-1.27; 40 24.13,1.27
FB805 = smd 1.3 x 1.5: 1 -0.85,0; 2 0.85,0
CHIP-LED0603 = smd 0.8 x 0.8: A 0,-0.75; C 0,0.75
CTS406 = smd 1.9 x 1.4: 1 -2.2,-1.2; 2 2.2,-1.2; 3 2.2,1.2; 4 -2.2,1.2
0402-RES = smd 0.7 x 0.9: 1 -0.65,0; 2 0.65,0
TACTILE_SWITCH_TALL = smd 1.55 x 1.3: A1 -3.975,-2.25; A2 3.975,-2.25; B1 -3.975,2.25; B2 3.975,2.25
LED-805 = smd 1.2 x 1.2: A 0,-1.05; C 0,1.05
LQFP48 = smd 0.25 x 1: 1 -2.75,-4.25; 2 -2.25,-4.25; 3 -1.75,-4.25; 4 -1.25,-4.25; 5 -0.75,-4.25; 6 -0.25,-4.25; 7 0.25,-4.25; 8 0.75,-4.25; 9 1.25,-4.25; 10 1.75,-4.25; 11 2.25,-4.25; 12 2.75,-4.25; 25 2.75,4.25; 26 2.25,4.25; 27 1.75,4.25; 28 1.25,4.25; 29 0.75,4.25; 30 0.25,4.25; 31 -0.25,4.25; 32 -0.75,4.25; 33 -1.25,4.25; 34 -1.75,4.25; 35 -2.25,4.25; 36 -2.75,4.25 | smd 1 x 0.25: 13 4.25,-2.75; 14 4.25,-2.25; 15 4.25,-1.75; 16 4.25,-1.25; 17 4.25,-0.75; 18 4.25,-0.25; 19 4.25,0.25; 20 4.25,0.75; 21 4.25,1.25; 22 4.25,1.75; 23 4.25,2.25; 24 4.25,2.75; 37 -4.25,2.75; 38 -4.25,2.25; 39 -4.25,1.75; 40 -4.25,1.25; 41 -4.25,0.75; 42 -4.25,0.25; 43 -4.25,-0.25; 44 -4.25,-0.75; 45 -4.25,-1.25; 46 -4.25,-1.75; 47 -4.25,-2.25; 48 -4.25,-2.75
QFN-24 = smd 0.8 x 0.3: 1 -2,1.25; 2 -2,0.75; 3 -2,0.25; 4 -2,-0.25; 5 -2,-0.75; 6 -2,-1.25; 13 2,-1.25; 14 2,-0.75; 15 2,-0.25; 16 2,0.25; 17 2,0.75; 18 2,1.25 | smd 0.3 x 0.8: 7 -1.25,-2; 8 -0.75,-2; 9 -0.25,-2; 10 0.25,-2; 11 0.75,-2; 12 1.25,-2; 19 1.25,2; 20 0.75,2; 21 0.25,2; 22 -0.25,2; 23 -0.75,2; 24 -1.25,2
VCNL4000 = smd 0.35 x 0.805: 1 -1.5,-1.772; 2 -0.75,-1.772; 3 0,-1.772; 4 0.75,-1.772; 5 1.5,-1.772; 7 1.5,1.772; 8 0.75,1.772; 9 0,1.772; 10 -0.75,1.772; 11 -1.5,1.772 | smd 0.805 x 0.4: 6 1.772,-0.715; 12 -1.772,-0.175
MICROSD = smd 0.7 x 1.5: 1 9,-10.64; 2 7.9,-10.24; 3 6.8,-10.64; 4 5.7,-11.04; 5 4.6,-10.64; 6 3.5,-11.04; 7 2.4,-10.64; 8 1.3,-10.64 | smd 1.8 x 1.4: CD1 2,-0.44; CD2 8,-0.44 | smd 1.4 x 1.9: MT1 0.4,-13.54; MT2 13.6,-14.44
CHIPLED_0805 = smd 1.2 x 1.2: A 0,-1.05; C 0,1.05
UX60-MB-5S8 = smd 2 x 0.5: 1 8.65,1.6; 2 8.65,0.8; 3 8.65,0; 4 8.65,-0.8; 5 8.65,-1.6 | drill 0.8 long: M1 3.1,-3.65; M2 3.1,3.65; M3 8.4,3.65; M4 8.4,-3.65 | hole 0.9: 6.4,-1.75; 6.4,1.75
STX3100 = drill 1.5 pad 2.54: 1 2.7,-0.1 | drill 1.5: 2 7.7,5; 3 7.7,2.3; 4 7.7,-2.5; 5 7.7,-5.2 | hole 1.5: 2.7,4.9; 2.7,-5.1; 7.7,-0.1

### Placement (x,y rotation side)
1V8_LDO  98.65,79.04 180 top
2V8_LDO  104.29,79.04 180 top
3V3_LDO  13.46,20.93 270 top
C1  41.35,45.97 270 top
C2  43.89,35.81 90 top
C3_3V3_LDO  18.19,21.89 0 top
C4_3V3_LDO  17.73,20.17 0 top
C5_2V8_LDO  105.11,74.07 270 top
C6_2V8_LDO  103.23,75.03 270 top
C7_1V8_LDO  99.62,73.96 270 top
C8_1V8_LDO  97.59,74.98 270 top
C9  78.11,51.69 0 top
C10  78.11,45.21 0 top
C11  78.11,39.62 0 top
C12  78.11,33.66 0 top
C13  47.88,47.12 180 top
C14  47.88,43.18 180 top
C15  47.88,36.55 180 top
C16  47.88,35.18 180 top
C17  70.74,28.32 270 top
C18  65.79,28.32 270 top
C19  60.1,27.1 270 top
C20  53.98,28.32 270 top
C21  46.61,51.69 180 top
C22  54.23,58.55 90 top
C23  60.71,58.55 90 top
C24  65.79,58.55 90 top
C25  72.26,58.55 90 top
C26  44.04,29.87 0 top
C27  11.43,59.44 180 top
C28  87.73,65.84 0 top
C29  90.22,68.17 0 top
C30  88.6,71.58 0 top
C31  67.21,63.65 270 top
C32  73.86,70.99 180 top
C33  73.58,68.05 180 top
C34  79.27,77.37 90 top
C35  73.71,65.56 180 top
C36  80.72,61.98 270 top
C37  84.99,79.81 270 top
C38  77.42,77.37 90 top
C39  64.67,73.81 90 top
C40  83.34,77.37 270 top
C41  87.83,74.47 180 top
C42  87.45,68.5 270 top
C43  113.59,53.7 270 top
C44  101.4,60.55 0 top
C45  101.4,65.38 0 top
C46  86.36,31.75 180 top
C47  100.33,50.55 90 top
C48  100.33,45.72 90 top
C49  85.34,42.67 270 top
C50  85.34,46.74 270 top
C51  85.34,51.56 270 top
C52  86.36,55.12 180 top
C53  24.13,76.2 90 top
C54  28.19,75.44 0 top
C55_VBAT  46.61,52.96 0 top
IC1  62.99,43.43 0 top
IC2  92.96,43.43 0 top
IC3  45.87,22.25 270 top
J1  -12.04,40.39 270 top
JP1  83.82,85.34 0 top
JP2  33.02,85.34 0 top
JP4  83.82,3.05 0 top
JP5  33.02,3.05 0 top
L1  27.94,72.64 180 top
PWR_LED  1.07,14.12 180 top
Q1_STM  42.62,40.89 90 top
Q2  65.94,68.73 270 top
R1  46.43,39.62 0 top
R2  40.69,33.17 180 top
R2_PWR_LED  10.01,16.26 270 top
R3  43.99,28.5 180 top
R4  3.05,59.94 180 top
R5  6.6,58.42 180 top
R6  7.62,60.71 180 top
R7  68.99,68.73 90 top
R8  82.14,77.37 90 top
R9  87.78,73.3 0 top
R10  100.63,67.67 90 top
R11  100.63,58.27 270 top
R12  112.83,55.98 180 top
R13  102.92,68.43 0 top
R14  102.92,57.51 0 top
R15  80.98,77.37 90 top
R16  91.34,76.66 270 top
R17  74.52,64.01 180 top
R18  74.52,62.74 180 top
R19  74.52,61.42 180 top
R20  78.08,61.82 270 top
R21  88.85,61.93 0 top
R22  17.78,76.45 180 top
R23  28.45,70.1 90 top
R24  26.67,70.1 90 top
R25  24.89,70.1 90 top
R26  40.69,31.95 180 top
R27  40.69,30.73 180 top
R28  40.69,34.39 180 top
R29  -3.3,65.53 180 top
S1_RST  4.72,31.39 90 top
S2_USR_WKP  33.38,56.29 270 top
SD_LED  -4.57,62.48 180 top  (outside the outline)
U1  80.42,68.73 180 top
U2  43.89,60.05 0 top
U3  111.4,43.89 0 top
U$1  16,80.77 270 top
USR_LED1  38.15,41.61 0 top
USR_LED2  33.58,46.33 0 top
USR_LED3  33.58,36.88 0 top
USR_LED4  29.46,41.61 0 top
X1  -1.02,20.32 0 top
X2  116.38,62.84 180 top

### Tracks (layer width: path | path; a pad name or v marks a point on that pad's centre or on a via)
1V8  (via drill 0.33)  (12 unrouted)
  Top 0.152: 77.21,76.5 C38.1 77.36,76.66 76.66,76.66 76.12,76.12 v76.12,75.36
  pour Route3: 84.73,75.74 73.91,75.74 72.69,74.52 72.69,60.2 73.76,59.13 83.36,59.13 83.67,59.44 83.67,59.59 83.36,59.89 74.07,59.89 73.46,60.5 73.46,74.22 74.22,74.98 85.04,74.98 86.56,76.5 85.5,76.5
2V8  (9 unrouted)
3V3  (64 unrouted)
  Top 0.152: IC1.72 65.74,29.02 C18.1 | 49.67,47.12 IC1.15 | U1.6
  pour Route3 (isolate 0.152, rank 6): 116.33,88.14 0.25,88.14 0.25,0.25 116.33,0.25
GND  (108 unrouted)
  pour Bottom (isolate 0.152, rank 6): 116.33,88.14 0.25,88.14 0.25,0.25 116.33,0.25
  pour Route2 (isolate 0.152, rank 6): 116.33,88.14 0.25,88.14 0.25,0.25 116.33,0.25
  pour Top (isolate 0.152, rank 6): 0.25,88.14 0.25,0.25 116.33,0.25 116.33,88.14
GPIO  (8 unrouted)
HP_GBUF_OUT  (2 unrouted)
HP_L_OUT  (1 unrouted)
HP_LEFT  (2 unrouted)
  Top 0.406: 100.75,57.51 R11.2
HP_R_OUT  (1 unrouted)
HP_RIGHT  (2 unrouted)
  Top 0.406: 100.75,68.43 R10.2
LINEINR  (1 unrouted)
MICP_LINEINL  (1 unrouted)
MP3_CS  (1 unrouted)
MP3_MISO  (1 unrouted)
MP3_MOSI  (1 unrouted)
MP3_RST  (1 unrouted)
MP3_RX  (1 unrouted)
MP3_SCLK  (1 unrouted)
N$1
  Top 0.406: PWR_LED.A 9.27,14.87 R2_PWR_LED.2
N$2
  Top 0.152: R1.1 44.75,39.62 Q1_STM.1 43.82,36.53
  Top 0.203: 44.16,38.35 Q1_STM.1 | 43.82,36.53 C2.2
N$3  (3 unrouted)
N$4  (1 unrouted)
N$6  (1 unrouted)
  Top 0.406: 113.48,54.46 C43.1
N$7  (1 unrouted)
  Top 0.406: 100.63,60.44 C44.1
N$9  (1 unrouted)
  Top 0.406: 100.63,65.49 C45.1
N$11
  Top 0.152: R8.2 C40.1
N$13
  Top 0.152: R9.2 88.43,74.42 C41.1
N$17  (1 unrouted)
N$19
  Top 0.152: R28.2 40.04,34.48 38.25,36.27 38.25,40.45 USR_LED1.A
N$20
  Top 0.152: USR_LED2.A 33.53,45.23 33.53,44.04 36.58,41 36.58,33.98 37.39,33.17 R2.2
N$21
  Top 0.152: R26.2 34.95,31.95 33.53,33.38 33.53,35.78 USR_LED3.A
N$22
  Top 0.152: R27.2 31.6,30.73 29.41,32.92 29.41,40.5 USR_LED4.A
N$23  (1 unrouted)
NRST  (3 unrouted)
OSC_IN
  Top 0.152: IC1.29 48.92,40.18 48.21,40.89 42.62,40.89 41.35,42.16 | C1.2 41.35,43.16
  Top 0.203: 41.35,42.16 41.35,43.02 Q1_STM.3 41.35,43.16
OSC_OUT
  Top 0.152: 49.68,39.62 R1.2
  Top 0.203: 49.68,39.62 IC1.30
PA0_WKUP  (1 unrouted)
PA3  (1 unrouted)
PA4  (1 unrouted)
PA5  (1 unrouted)
PA6  (1 unrouted)
PA7  (1 unrouted)
PA12  (2 unrouted)
PA14  (1 unrouted)
PA15  (1 unrouted)
PB0  (1 unrouted)
PB1  (1 unrouted)
PB2  (1 unrouted)
PB3  (1 unrouted)
PB4  (1 unrouted)
PB5  (2 unrouted)
PB6  (2 unrouted)
PB7  (1 unrouted)
PB8  (1 unrouted)
PB9  (1 unrouted)
PB10  (1 unrouted)
PB11  (1 unrouted)
PC0  (2 unrouted)
PC1  (1 unrouted)
PC2  (1 unrouted)
PC3  (1 unrouted)
PC4  (1 unrouted)
PC5  (1 unrouted)
PC10  (1 unrouted)
PC11  (1 unrouted)
PC12  (1 unrouted)
PD0  (2 unrouted)
PD1  (2 unrouted)
PD2  (1 unrouted)
PD3  (1 unrouted)
PD4  (1 unrouted)
PD5  (1 unrouted)
PD6  (1 unrouted)
PD7  (1 unrouted)
PD8  (1 unrouted)
PD9  (1 unrouted)
PD10  (1 unrouted)
PD14  (1 unrouted)
PD15  (1 unrouted)
PE0  (2 unrouted)
PE1  (2 unrouted)
PE7  (2 unrouted)
PE8  (2 unrouted)
PE9  (2 unrouted)
PE10  (2 unrouted)
PE11  (2 unrouted)
PE12  (2 unrouted)
PE13  (2 unrouted)
PE14  (2 unrouted)
PE15  (2 unrouted)
PF0  (1 unrouted)
PF1  (1 unrouted)
PF2  (1 unrouted)
PF3  (1 unrouted)
PF4  (1 unrouted)
PF5  (1 unrouted)
PF11  (2 unrouted)
PF12  (2 unrouted)
PF13  (2 unrouted)
PF14  (2 unrouted)
PF15  (2 unrouted)
PG0  (2 unrouted)
PG1  (2 unrouted)
PG4  (1 unrouted)
PG5  (1 unrouted)
PG8  (1 unrouted)
PG9  (1 unrouted)
PG10  (1 unrouted)
PG11  (1 unrouted)
PG12  (1 unrouted)
PG13  (1 unrouted)
PG14  (1 unrouted)
PG15  (2 unrouted)
PH4  (1 unrouted)
PH5  (1 unrouted)
PH6  (1 unrouted)
PH7  (1 unrouted)
PH8  (1 unrouted)
PH9  (1 unrouted)
PH10  (1 unrouted)
PH11  (1 unrouted)
PI2  (1 unrouted)
PI3  (1 unrouted)
PI4  (1 unrouted)
PI5  (1 unrouted)
PI6  (1 unrouted)
PI7  (1 unrouted)
RCAP  (1 unrouted)
SD_DATA_OUT  (2 unrouted)
USB_5V  (5 unrouted)
  Top 0.406: X1.1 9.63,21.92 9.91,21.64 9.91,17.01 R2_PWR_LED.1
USB_D+  (1 unrouted)
USB_D-  (1 unrouted)
VCC_MMC  (6 unrouted)
XTALI  (1 unrouted)
  Top 0.203: Q2.3 67.14,64.37 C31.1
  Top 0.254: U1.18 70,68.98 68.48,67.46 67.21,67.46 67.21,66.6 Q2.3
XTALO  (1 unrouted)
  Top 0.203: Q2.1 64.74,73.09 C39.1
  Top 0.254: U1.17 65.19,69.48 64.67,70 64.67,70.86 Q2.1